# EasyEDA Pro project G431主控板.eprj

# Schematic Schematic1

## Sheets
1 P1: Board Name: Board1; Create Date: 2025-03-21; Page Name: P1; Project Name: G431主控板; Schematic Name: Schematic1; Update Date: 2025-05-21; Company: 嘉立创EDA; Page Size: A4; Version: V1.0
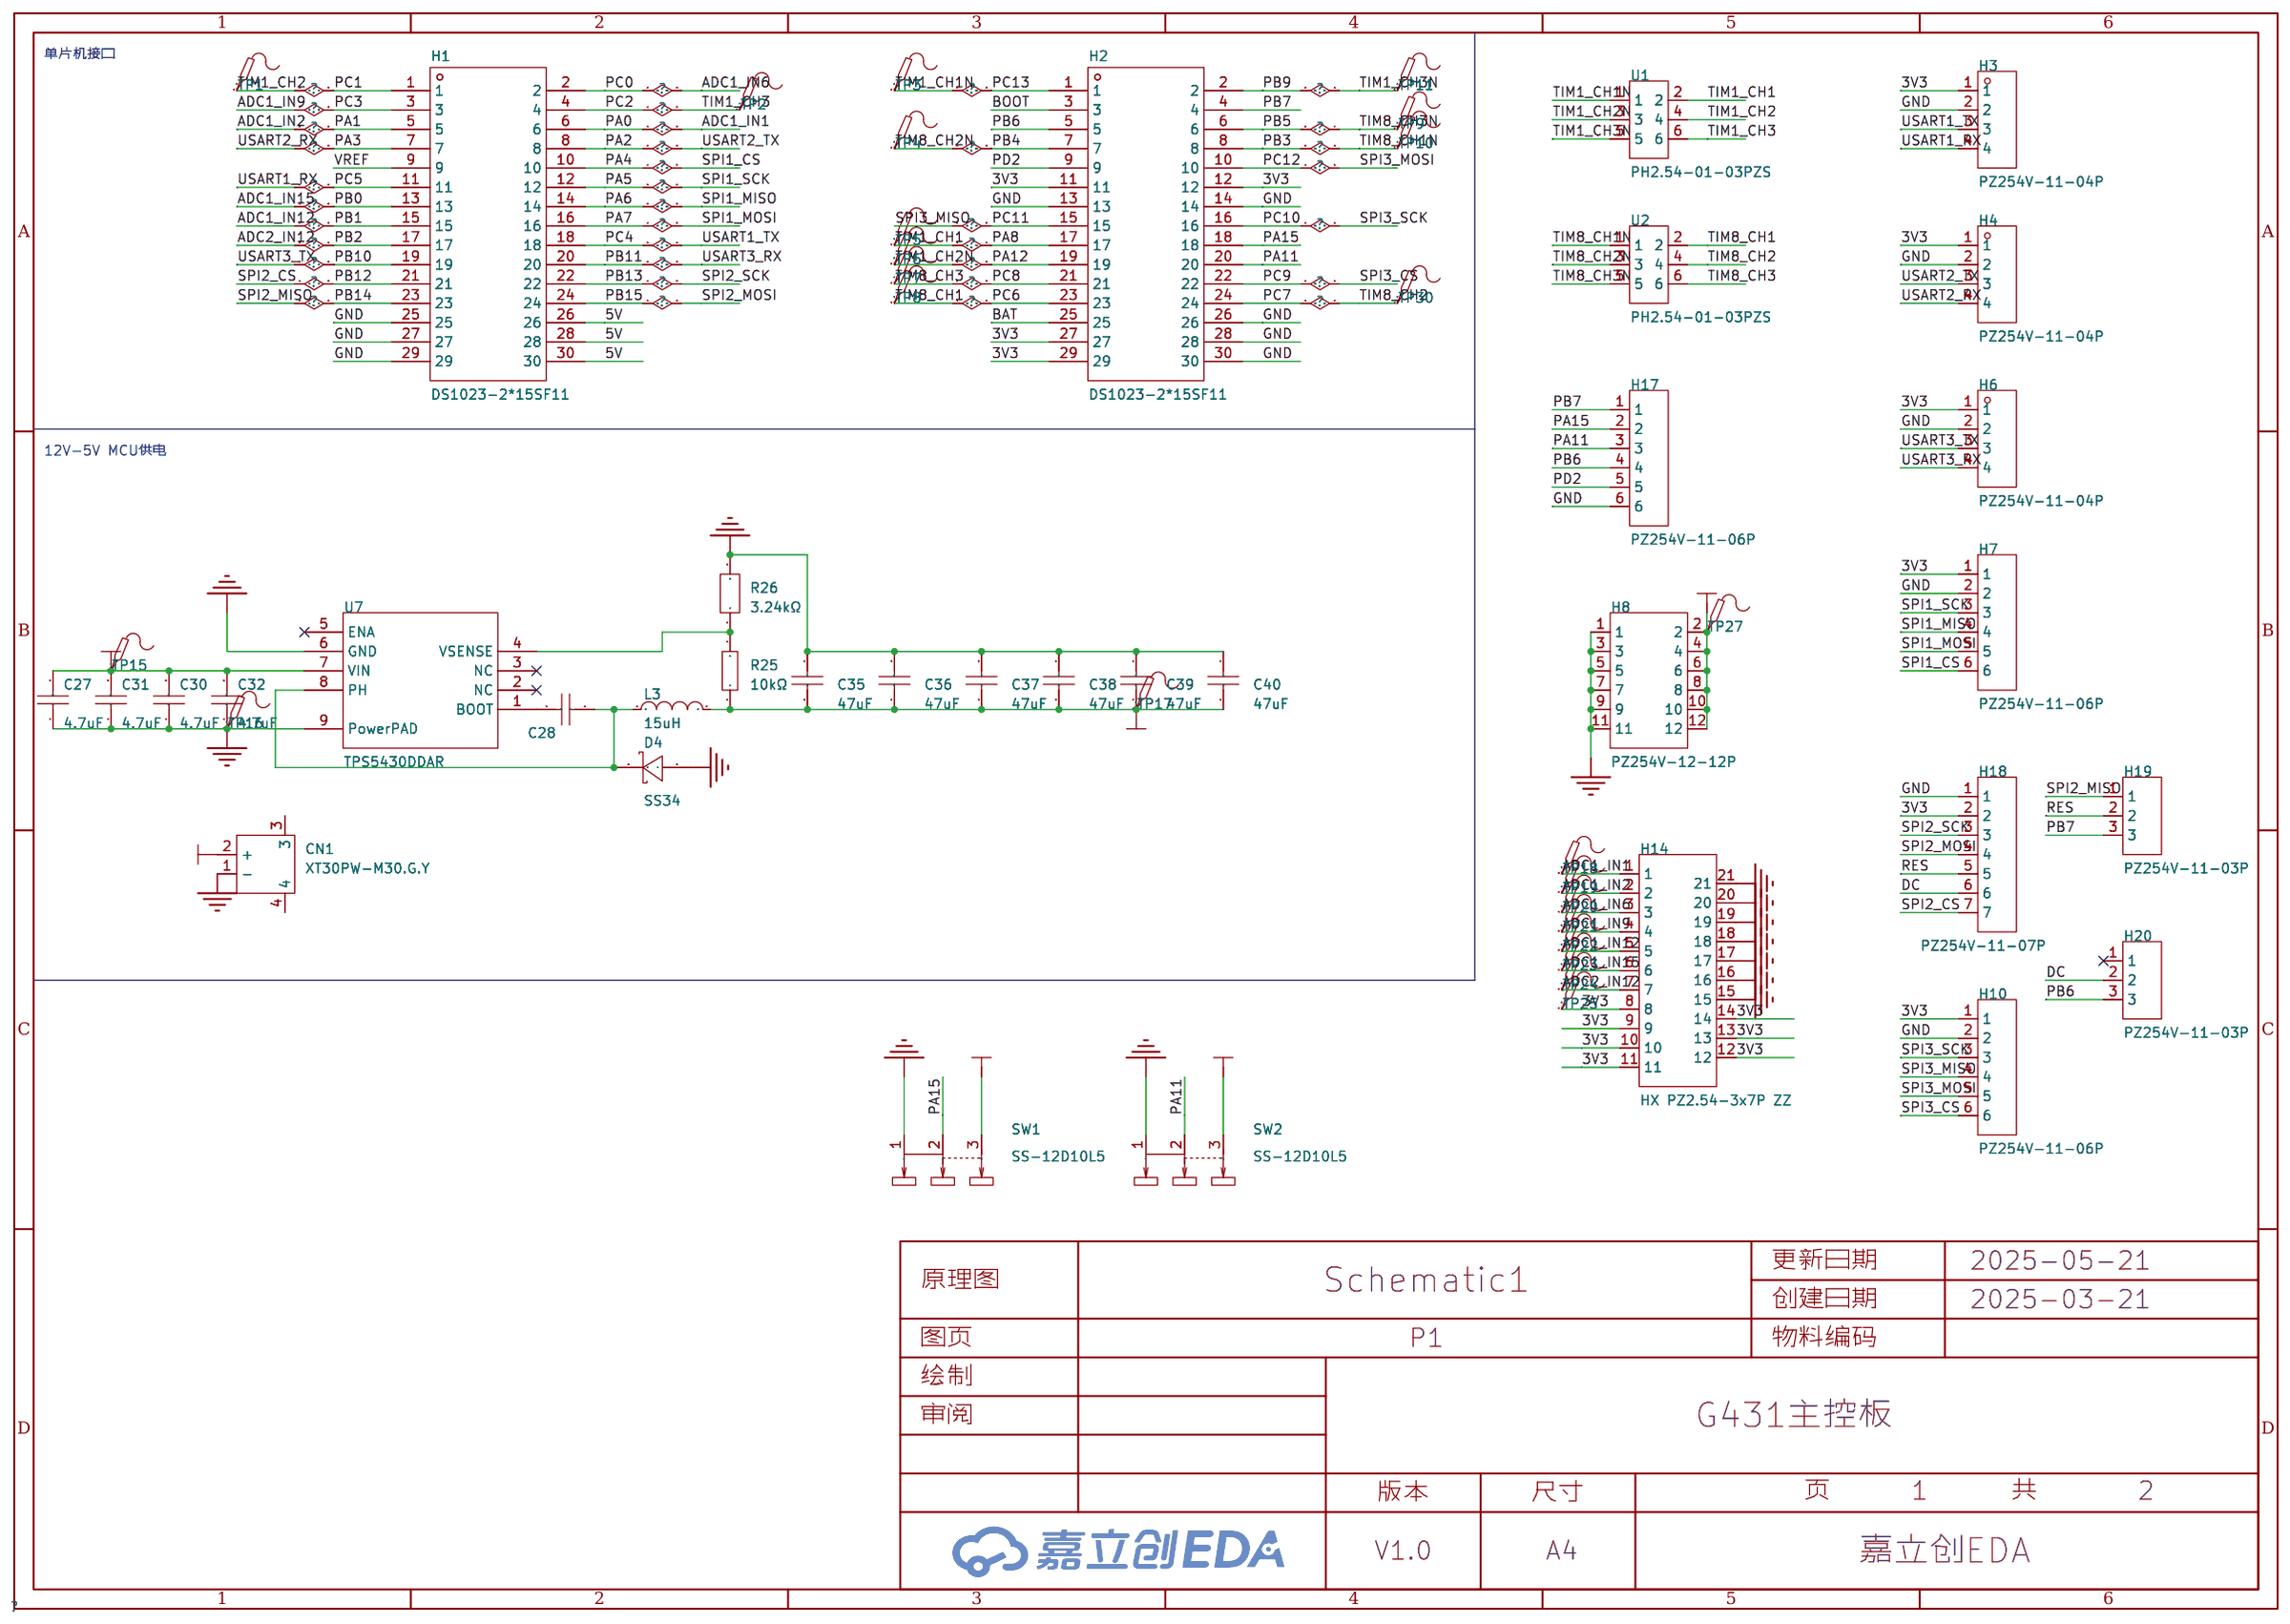
[diagram p0: P1]
2 P2: Create Date: 2025-05-21; Page Name: P2
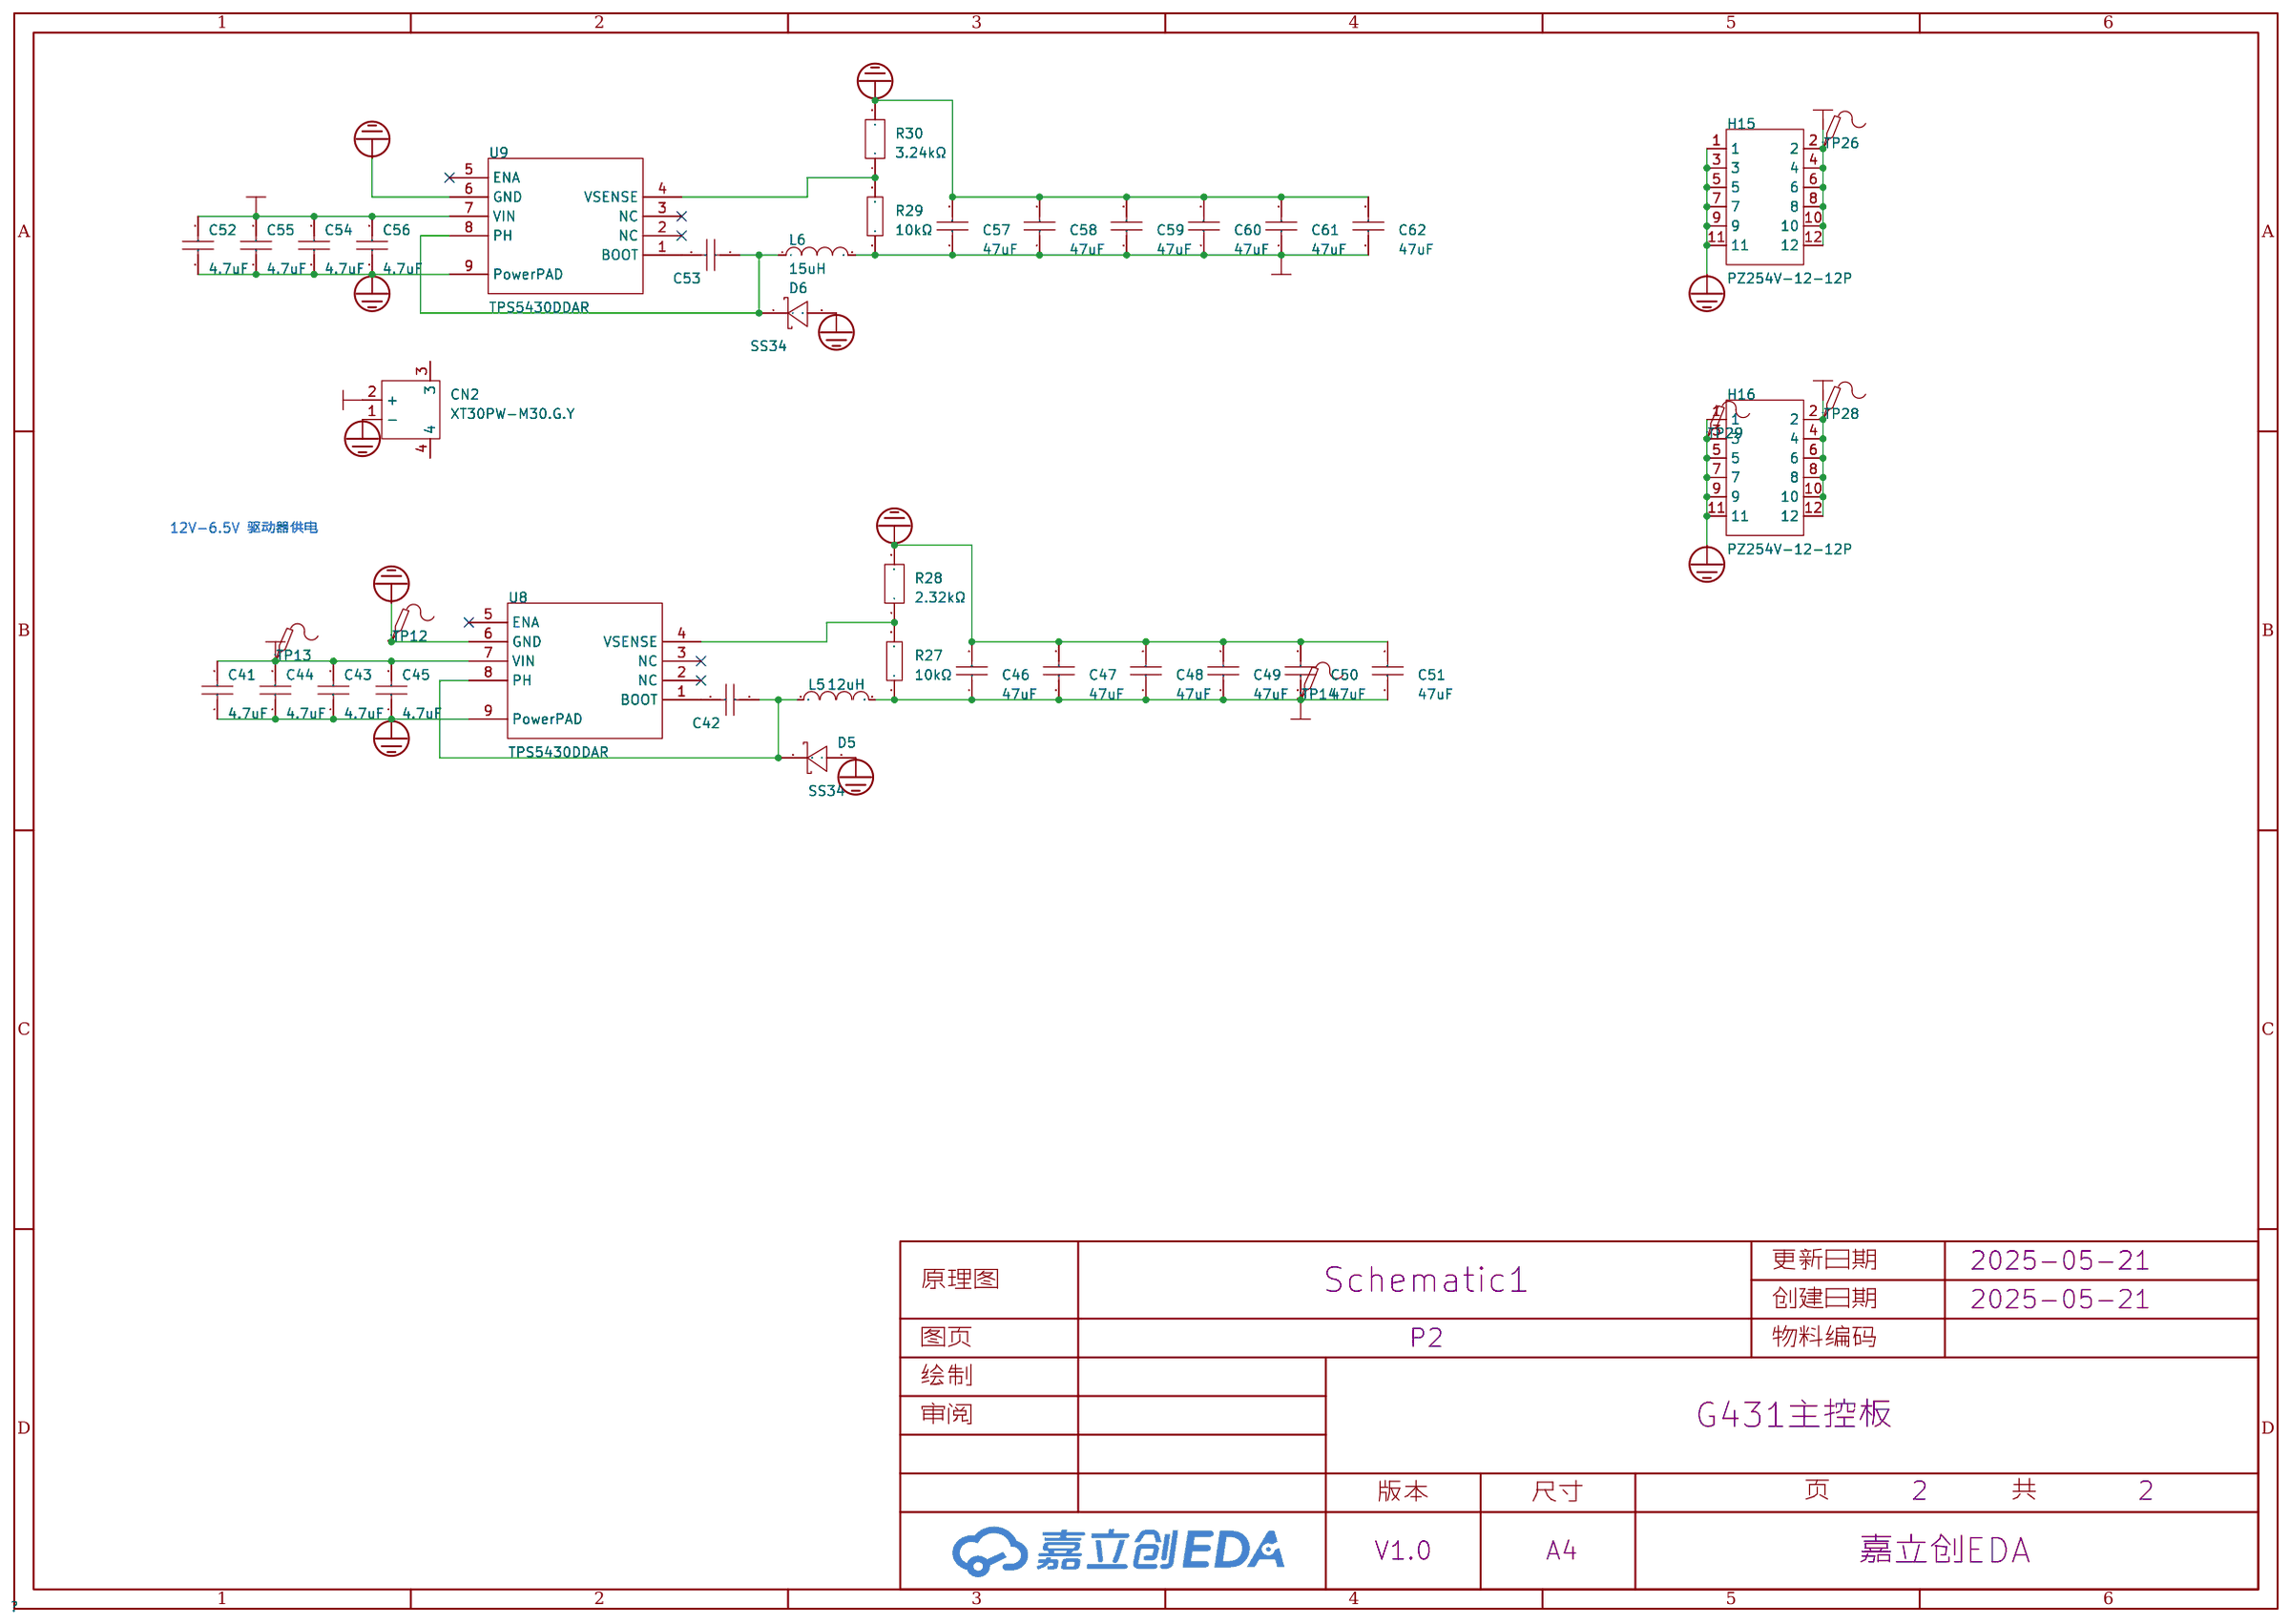
[diagram p1: P2]

## Parts
sheet P1
C27  4.7uF  [C0603]
C28  10nF  [C0603]
C30  4.7uF  [C0603]
C31  4.7uF  [C0603]
C32  4.7uF  [C0603]
C35  47uF  [C0805]
C36  47uF  [C0805]
C37  47uF  [C0805]
C38  47uF  [C0805]
C39  47uF  [C0805]
C40  47uF  [C0805]
CN1  XT30PW-M30.G.Y  [CONN-TH_XT30PW-M]
D4  SS34  [SMA_L4.3-W2.6-LS5.2-RD]
H1  DS1023-2*15SF11  [HDR-TH_30P-P2.54-V-F-R2-C15-S2.54]
H2  DS1023-2*15SF11  [HDR-TH_30P-P2.54-V-F-R2-C15-S2.54]
H3  PZ254V-11-04P  [HDR-TH_4P-P2.54-V-M]
H4  PZ254V-11-04P  [HDR-TH_4P-P2.54-V-M]
H6  PZ254V-11-04P  [HDR-TH_4P-P2.54-V-M]
H7  PZ254V-11-06P  [HDR-TH_6P-P2.54-V-M]
H8  PZ254V-12-12P  [HDR-TH_12P-P2.54-V-M-R2-C6-S2.54]
H10  PZ254V-11-06P  [HDR-TH_6P-P2.54-V-M]
H14  HX PZ2.54-3x7P ZZ  [CONN-TH_HX-PZ2.54-3X7P-ZZ]
H17  PZ254V-11-06P  [HDR-TH_6P-P2.54-V-M]
H18  PZ254V-11-07P  [HDR-TH_7P-P2.54-V-M]
H19  PZ254V-11-03P  [HDR-TH_3P-P2.54-V-M]
H20  PZ254V-11-03P  [HDR-TH_3P-P2.54-V-M]
L3  15uH  [IND-SMD_L5.2-W5.2_YSPI0530]
R25  10kΩ  [R0603]
R26  3.24kΩ  [R0603]
SW1  SS-12D10L5  [SW-TH_SS-12D10L5]
SW2  SS-12D10L5  [SW-TH_SS-12D10L5]
TP1  -  [Test-Point-0.5mm]
TP2  -  [Test-Point-0.5mm]
TP3  -  [Test-Point-0.5mm]
TP4  -  [Test-Point-0.5mm]
TP5  -  [Test-Point-0.5mm]
TP6  -  [Test-Point-0.5mm]
TP7  -  [Test-Point-0.5mm]
TP8  -  [Test-Point-0.5mm]
TP9  -  [Test-Point-0.5mm]
TP10  -  [Test-Point-0.5mm]
TP11  -  [Test-Point-0.5mm]
TP15  -  [Test-Point-0.5mm]
TP16  -  [Test-Point-0.5mm]
TP17  -  [Test-Point-0.5mm]
TP18  -  [Test-Point-0.5mm]
TP19  -  [Test-Point-0.5mm]
TP20  -  [Test-Point-0.5mm]
TP21  -  [Test-Point-0.5mm]
TP22  -  [Test-Point-0.5mm]
TP23  -  [Test-Point-0.5mm]
TP24  -  [Test-Point-0.5mm]
TP25  -  [Test-Point-0.5mm]
TP27  -  [Test-Point-0.5mm]
TP30  -  [Test-Point-0.5mm]
U1  PH2.54-01-03PZS  [HDR-TH_6P-P2.54-V-M-R2-C3-S2.54]
U2  PH2.54-01-03PZS  [HDR-TH_6P-P2.54-V-M-R2-C3-S2.54]
U7  TPS5430DDAR  [ESOP-8_L4.9-W3.9-P1.27-LS6.0-TL-EP]
sheet P2
C41  4.7uF  [C0603]
C42  10nF  [C0603]
C43  4.7uF  [C0603]
C44  4.7uF  [C0603]
C45  4.7uF  [C0603]
C46  47uF  [C0805]
C47  47uF  [C0805]
C48  47uF  [C0805]
C49  47uF  [C0805]
C50  47uF  [C0805]
C51  47uF  [C0805]
C52  4.7uF  [C0603]
C53  10nF  [C0603]
C54  4.7uF  [C0603]
C55  4.7uF  [C0603]
C56  4.7uF  [C0603]
C57  47uF  [C0805]
C58  47uF  [C0805]
C59  47uF  [C0805]
C60  47uF  [C0805]
C61  47uF  [C0805]
C62  47uF  [C0805]
CN2  XT30PW-M30.G.Y  [CONN-TH_XT30PW-M]
D5  SS34  [SMA_L4.3-W2.6-LS5.2-RD]
D6  SS34  [SMA_L4.3-W2.6-LS5.2-RD]
H15  PZ254V-12-12P  [HDR-TH_12P-P2.54-V-M-R2-C6-S2.54]
H16  PZ254V-12-12P  [HDR-TH_12P-P2.54-V-M-R2-C6-S2.54]
L5  12uH  [IND-SMD_L4.0-W4.0]
L6  15uH  [IND-SMD_L5.2-W5.2_YSPI0530]
R27  10kΩ  [R0603]
R28  2.32kΩ  [R0603]
R29  10kΩ  [R0603]
R30  3.24kΩ  [R0603]
TP12  -  [Test-Point-0.5mm]
TP13  -  [Test-Point-0.5mm]
TP14  -  [Test-Point-0.5mm]
TP26  -  [Test-Point-0.5mm]
TP28  -  [Test-Point-0.5mm]
TP29  -  [Test-Point-0.5mm]
U8  TPS5430DDAR  [ESOP-8_L4.9-W3.9-P1.27-LS6.0-TL-EP]
U9  TPS5430DDAR  [ESOP-8_L4.9-W3.9-P1.27-LS6.0-TL-EP]

## Library data of the parts
C27 C30-C32 C41 C43-C45 C52 C54-C56 = CL10A475KP8NNNC: 容值:4.7uF;精度:±10%;额定电压:10V;材质(温度系数):X5R;; LCSC Part Name: 4.7uF ±10% 10V; Supplier Part: C1705; Manufacturer: SAMSUNG(三星); Supplier Footprint: 0603; JLCPCB Part Class: 扩展库; Datasheet: https://atta.szlcsc.com/upload/public/pdf/source/20160218/1457707763339.pdf; Supplier: LCSC; Tolerance: ±10%; Voltage Rated: 10V; Temperature Coefficient: X5R
C28 C42 C53 = CC0603KRX7R9BB103: LCSC Part Name: 10nF ±10% 50V; Supplier Part: C100042; Manufacturer: YAGEO(国巨); Supplier Footprint: 0603; JLCPCB Part Class: 扩展库; Datasheet: https://atta.szlcsc.com/upload/public/pdf/source/20181008/C309510_22F155564471FAF6A489F7D68F34234E.pdf; Supplier: LCSC; Tolerance: ±10%; Voltage Rated: 50V; Temperature Coefficient: X7R
C35-C40 C46-C51 C57-C62 = CL21A476MQYNNNE: 容值:47uF;精度:±20%;额定电压:6.3V;材质(温度系数):X5R;; LCSC Part Name: 47uF ±20% 6.3V; Supplier Part: C16780; Manufacturer: SAMSUNG(三星); Supplier Footprint: 0805; JLCPCB Part Class: 基础库; Datasheet: https://atta.szlcsc.com/upload/public/pdf/source/20160218/1457707763339.pdf; Supplier: LCSC; Tolerance: ±20%; Voltage Rated: 6.3V; Temperature Coefficient: X5R
CN1 CN2 = XT30PW-M30.G.Y: LCSC Part Name: AMASS(艾迈斯)航模插头 卧式弯脚 XT30PW-M公头; Supplier Part: C431092; Manufacturer: AMASS(艾迈斯); JLCPCB Part Class: 扩展库; Datasheet: https://atta.szlcsc.com/upload/public/pdf/source/20220222/6A9F22F7850E25B33E1BE430ADF8560B.pdf; Supplier: LCSC; Type: 航模插头; RatedVoltage: DC 500V; InterfaceType: 公头; RatedCurrent: 15A; RecommendedWireGauge: 16/18/20AWG; contact resistance: 1.2mΩ; specifications: 2pin
D4-D6 = SS34_C8678: 二极管配置:独立式;正向压降(Vf):550mV@3A;直流反向耐压(Vr):40V;平均整流电流(Io):3A;; LCSC Part Name: 电压:40V 电流:3A; Supplier Part: C8678; Manufacturer: MDD; Supplier Footprint: SMA(DO-214AC); JLCPCB Part Class: 基础库; Datasheet: https://atta.szlcsc.com/upload/public/pdf/source/20230314/A80AE34493C69B89E2F4B1712F433538.pdf; Supplier: LCSC; Diode Configuration: 独立式; Forward Voltage (Vf@If): 550mV@3A; Reverse Voltage (Vr): 40V; Average Rectified Current (Io): 3A; Reverse Leakage Current (Ir): 500uA@40V
H1 H2 = DS1023-2*15SF11: 插孔结构:2x15P;间距:2.54mm;行距:2.54mm;安装类型:直插;排数:双排;总孔位数:30P;塑高:-;触头材质:-;触头镀层:-;; LCSC Part Name: 间距:2.54mm 2x15P 直插; Supplier Part: C132129; Manufacturer: CONNFLY; Supplier Footprint: 插件,P=2.54mm; JLCPCB Part Class: 扩展库; Datasheet: https://atta.szlcsc.com/upload/public/pdf/source/20170925/C132132_1506321659018990428.pdf; Supplier: LCSC; Holes Structure: 2x15P; Pitch: 2.54mm; Row Spacing: 2.54mm; Mounting Type: 直插; Number of Rows: 双排; Number of Holes: 30P
H3 H4 H6 = PZ254V-11-04P: LCSC Part Name: 间距:2.54mm 1x4P 直插 方针; Supplier Part: C2691448; Manufacturer: XFCN(兴飞); Supplier Footprint: 插件,P=2.54mm; JLCPCB Part Class: 扩展库; Datasheet: https://atta.szlcsc.com/upload/public/pdf/source/20200309/C492403_F9F19131791D08044AD4F84F8E751A34.pdf; Supplier: LCSC; Pin Structure: 1x4P; Pitch: 2.54mm; Circluar Pins/Square Pins: 方针; Mounting Type: 直插; Number of Rows: 单排; Number of Pins: 4P; Current Rating (Max): 3A; Voltage Rating (Max): 250V; Length of Mating Pin: 6mm; Insulation Height: 2.5mm; Length of End Connection Pin: 3mm; Operating Temperature Range: -40℃~+105℃; Color: 黑色
H7 H10 H17 = PZ254V-11-06P: LCSC Part Name: 1x6P 间距:2.54mm 方针 直插; Supplier Part: C492405; Manufacturer: XFCN(兴飞); Supplier Footprint: 插件,P=2.54mm; JLCPCB Part Class: 扩展库; Datasheet: https://atta.szlcsc.com/upload/public/pdf/source/20200309/C492405_597F1930F5B55CC3C7FD95458F1C3977.pdf; Supplier: LCSC; Pin Structure: 1x6P; Pitch: 2.54mm; Circluar Pins/Square Pins: 方针; Mounting Type: 直插; Number of Rows: 单排; Number of Pins: 6P; Length of Mating Pin: 6mm; Insulation Height: 2.5mm; Length of End Connection Pin: 3mm; Contact Material: 黄铜; Operating Temperature: -40℃~+105℃; Color: 黑色
H8 H15 H16 = PZ254V-12-12P: LCSC Part Name: 2x6P 间距:2.54mm 方针 直插; Supplier Part: C492423; Manufacturer: XFCN(兴飞); Supplier Footprint: 插件,P=2.54mm; JLCPCB Part Class: 扩展库; Datasheet: https://atta.szlcsc.com/upload/public/pdf/source/20200309/C492423_E4E2C9BC0EB9D59A2ABE4377D2E234B2.pdf; Supplier: LCSC; Pin Structure: 2x6P; Pitch: 2.54mm; Row Spacing: 2.54mm; Circluar Pins/Square Pins: 方针; Mounting Type: 直插; Number of Rows: 双排; Number of Pins: 12P; Length of Mating Pin: 6mm; Insulation Height: 2.5mm; Length of End Connection Pin: 3mm; Contact Material: 黄铜; Operating Temperature: -40℃~+105℃; Color: 黑色
H14 = HX PZ2.54-3x7P ZZ: LCSC Part Name: 3x7P 间距:2.54mm 方针 直插; Supplier Part: C32713294; Manufacturer: hanxia(韩下); Supplier Footprint: 插件,P=2.54mm; JLCPCB Part Class: 扩展库; Datasheet: https://atta.szlcsc.com/upload/public/pdf/source/20240723/0865035114635720ADAE8B7B33218890.pdf; Supplier: LCSC; Pin Structure: 3x7P; Pitch: 2.54mm; Row Spacing: 2.54mm; Circluar Pins/Square Pins: 方针; Mounting Type: 直插; Number of Rows: 三排; Number of Pins: 21P; Current Rating: 3A; Length of Mating Pin: 6mm; Insulation Height: 2.5mm; Length of End Connection Pin: 3mm; Contact Material: 黄铜; Contact Plating: 金; Operating Temperature: -40℃~+105℃; Color: 黑色
H18 = PZ254V-11-07P: LCSC Part Name: 1x7P 间距:2.54mm 方针 直插; Supplier Part: C492406; Manufacturer: XFCN(兴飞); Supplier Footprint: 插件,P=2.54mm; JLCPCB Part Class: 扩展库; Datasheet: https://atta.szlcsc.com/upload/public/pdf/source/20200309/C492406_654C533EE691117E22DD9F76C114C2D9.pdf; Supplier: LCSC; Pin Structure: 1x7P; Pitch: 2.54mm; Circluar Pins/Square Pins: 方针; Mounting Type: 直插; Number of Rows: 单排; Number of Pins: 7P; Length of Mating Pin: 6mm; Insulation Height: 2.5mm; Length of End Connection Pin: 3mm; Contact Material: 黄铜; Operating Temperature: -40℃~+105℃; Color: 黑色
H19 H20 = PZ254V-11-03P: LCSC Part Name: 1x3P 间距:2.54mm 方针 直插; Supplier Part: C2937625; Manufacturer: XFCN(兴飞); Supplier Footprint: 插件,P=2.54mm; JLCPCB Part Class: 扩展库; Datasheet: https://atta.szlcsc.com/upload/public/pdf/source/20200309/C492402_8335C3D49C4E4C618838D59BB1D024C1.pdf; Supplier: LCSC; Pin Structure: 1x3P; Pitch: 2.54mm; Circluar Pins/Square Pins: 方针; Mounting Type: 直插; Number of Rows: 单排; Number of Pins: 3P; Current Rating: 3A; Voltage Rating (Max): 250V; Length of Mating Pin: 6mm; Insulation Height: 2.5mm; Length of End Connection Pin: 3mm; Operating Temperature: -40℃~+105℃; Color: 黑色
L3 L6 = YSPI0530-150M: 电感值:15uH;精度:±20%;额定电流:2.1A;; LCSC Part Name: 15uH ±20%; Supplier Part: C497861; Manufacturer: YJYCOIN(益嘉源); Supplier Footprint: SMD,5.4x5.2x3mm; JLCPCB Part Class: 扩展库; Datasheet: https://atta.szlcsc.com/upload/public/pdf/source/20200317/C497860_F2BFA4F4324DE880FC2D7AD862E4A32B.pdf; Supplier: LCSC; Tolerance: ±20%; Rated Current: 2.1A; DC Resistance (DCR): 190mΩ
R25 R27 R29 = RT0603BRD0710KL: 电阻类型:薄膜电阻;阻值:10kΩ;精度:±0.1%;功率:100mW;最大工作电压:75V;温度系数:±25ppm/℃;; LCSC Part Name: 薄膜电阻 10kΩ ±0.1% 100mW; Supplier Part: C95204; Manufacturer: YAGEO(国巨); Supplier Footprint: 0603; JLCPCB Part Class: 扩展库; Datasheet: https://atta.szlcsc.com/upload/public/pdf/source/20170217/1487301593756.pdf; Supplier: LCSC; Type: 薄膜电阻; Tolerance: ±0.1%; Power(Watts): 100mW; Overload Voltage (Max): 75V; Temperature Coefficient: ±25ppm/℃; Operating Temperature Range: -55℃~+155℃
R26 R30 = RT0603BRB073K24L: 电阻类型:薄膜电阻;阻值:3.24kΩ;精度:±0.1%;功率:100mW;温度系数:±10ppm/℃;; LCSC Part Name: 薄膜电阻 3.24kΩ ±0.1% 100mW; Supplier Part: C860367; Manufacturer: YAGEO(国巨); Supplier Footprint: 0603; JLCPCB Part Class: 扩展库; Datasheet: https://atta.szlcsc.com/upload/public/pdf/source/20200610/C326738_5639A9F1B6EB6E4AE2197577D3456E7F.pdf; Supplier: LCSC; Type: 薄膜电阻; Tolerance: ±0.1%; Power(Watts): 100mW; Temperature Coefficient: ±10ppm/℃; Operating Temperature Range: -55℃~+155℃
SW1 SW2 = SS-12D10L5: LCSC Part Name: 柄长5mm 直插双档 滑动开关; Supplier Part: C319012; Manufacturer: XKB Connectivity(中国星坤); Supplier Footprint: 插件; JLCPCB Part Class: 扩展库; Datasheet: https://atta.szlcsc.com/upload/public/pdf/source/20211009/D6412F37AABE6F9459A6EE7FA4DAEADB.pdf; Supplier: LCSC; Circuit: 单刀双掷; Actuator Style: 矩形柱状; Pin Style: PC引脚; Switch Length: 13mm; Switch Width: 6.8mm; Switch Height: 6.4mm; Mounting Style: 直插; Actuator Color: 黑色; Current Rating (DC): 3A; Voltage Rating (DC): 125V; Current Rating (AC): 3A; Voltage Rating (AC): 125V; Mechanical Life: 1万次; Operating Temperature: -40℃~+85℃
TP1-TP30 = Test-Point
U1 U2 = PH2.54-01-03PZS: LCSC Part Name: 2x3P 间距:2.54mm 方针 直插; Supplier Part: C7501594; Manufacturer: XUNPU(讯普); Supplier Footprint: 插件,P=2.54mm; JLCPCB Part Class: 扩展库; Datasheet: https://atta.szlcsc.com/upload/public/pdf/source/20241122/C6659771919859911C7FDF3F9F3812CF.pdf; Supplier: LCSC; Pin Structure: 2x3P; Pitch: 2.54mm; Circluar Pins/Square Pins: 方针; Mounting Type: 直插; Number of Rows: 双排; Number of Pins: 6P; Length of Mating Pin: 6mm; Insulation Height: 2.5mm; Length of End Connection Pin: 3mm; Contact Material: 黄铜; Operating Temperature: -40℃~+105℃; Color: 黑色
U7-U9 = TPS5430DDAR: LCSC Part Name: 宽输入范围、3A输出电流的降压转换器; Supplier Part: C9864; Manufacturer: TI(德州仪器); Supplier Footprint: SOIC-8-EP; JLCPCB Part Class: 基础库; Datasheet: https://www.ti.com/cn/lit/gpn/tps5430; Supplier: LCSC; Function: 降压型; Output Type: 可调; Input Voltage: 5.5V~36V; Output Voltage: 1.221V~32.04V; Output Current: 3A; Switching Frequency: 500kHz; Operating Temperature: -40℃~+125℃@(TJ); Synchronous Rectification: 否; Number of Outputs: 1; Topology: 降压式; Switch tube (built-in/external): 内置; Output Current (Max): 3A
L5 = YNR4012-120M: LCSC Part Name: 12uH ±20%; Supplier Part: C497783; Manufacturer: YJYCOIN(益嘉源); Supplier Footprint: SMD,4x4x1.2mm; JLCPCB Part Class: 扩展库; Datasheet: https://atta.szlcsc.com/upload/public/pdf/source/20200317/C497775_B97ACFD3F1553E2A8E8AA921B9B778DC.pdf; Supplier: LCSC; Tolerance: ±20%; Rated Current: 660mA; DC Resistance (DCR): 290mΩ
R28 = RT0603BRD072K32L: LCSC Part Name: 薄膜电阻 2.32kΩ ±0.1% 100mW; Supplier Part: C861296; Manufacturer: YAGEO(国巨); Supplier Footprint: 0603; JLCPCB Part Class: 扩展库; Datasheet: https://atta.szlcsc.com/upload/public/pdf/source/20200610/C326738_5639A9F1B6EB6E4AE2197577D3456E7F.pdf; Supplier: LCSC; Type: 薄膜电阻; Tolerance: ±0.1%; Power(Watts): 100mW; Temperature Coefficient: ±25ppm/℃; Operating Temperature: -55℃~+155℃

## Nets
3V3: H2.11 H2.12 H2.27 H2.29 H3.1 H4.1 H6.1 H7.1 H10.1 H14.8 H14.9 H14.10 H14.11 H14.12 H14.13 H14.14 H18.2 SW1.3 SW2.3 TP25.1
5V: C35.1 C36.1 C37.1 C38.1 C39.1 C40.1 H1.26 H1.28 H1.30 H8.2 H8.4 H8.6 H8.8 H8.10 H8.12 L3.2 R25.1 TP17.1 TP27.1
5V_SAMPLE: C57.1 C58.1 C59.1 C60.1 C61.1 C62.1 H16.2 H16.4 H16.6 H16.8 H16.10 H16.12 L6.2 R29.1 TP28.1
6.5V: C46.1 C47.1 C48.1 C49.1 C50.1 C51.1 H15.2 H15.4 H15.6 H15.8 H15.10 H15.12 L5.2 R27.1 TP14.1 TP26.1
12V: C27.2 C30.2 C31.2 C32.2 CN1.2(+) TP15.1 U7.7(VIN)
12V_SAMPLE: C41.2 C43.2 C44.2 C45.2 C52.2 C54.2 C55.2 C56.2 CN2.2(+) TP13.1 U8.7(VIN) U9.7(VIN)
GND: C27.1 C30.1 C31.1 C32.1 C35.2 C36.2 C37.2 C38.2 C39.2 C40.2 CN1.1(-) D4.2(A) H1.25 H1.27 H1.29 H2.13 H2.14 H2.26 H2.28 H2.30 H3.2 H4.2 H6.2 H7.2 H8.1 H8.3 H8.5 H8.7 H8.9 H8.11 H10.2 H14.15 H14.16 H14.17 H14.18 H14.19 H14.20 H14.21 H17.6 H18.1 R26.2 SW1.1 SW2.1 TP16.1 U7.6(GND) U7.9(PowerPAD)
PGND: C41.1 C43.1 C44.1 C45.1 C46.2 C47.2 C48.2 C49.2 C50.2 C51.2 C52.1 C54.1 C55.1 C56.1 C57.2 C58.2 C59.2 C60.2 C61.2 C62.2 CN2.1(-) D5.2(A) D6.2(A) H15.1 H15.3 H15.5 H15.7 H15.9 H15.11 H16.1 H16.3 H16.5 H16.7 H16.9 H16.11 R28.2 R30.2 TP12.1 TP29.1 U8.6(GND) U8.9(PowerPAD) U9.6(GND) U9.9(PowerPAD)
ADC1_IN1: H1.6 H14.1 TP18.1
ADC1_IN2: H1.5 H14.2 TP19.1
ADC1_IN6: H1.2 H14.3 TP20.1
ADC1_IN9: H1.3 H14.4 TP21.1
ADC1_IN12: H1.15 H14.5 TP22.1
ADC1_IN15: H1.13 H14.6 TP23.1
ADC2_IN12: H1.17 H14.7 TP24.1
BAT: H2.25
BOOT: H2.3
DC: H18.6 H20.2
PA2: H1.8 H4.3
PA3: H1.7 H4.4
PA4: H1.10 H7.6
PA5: H1.12 H7.3
PA6: H1.14 H7.4
PA7: H1.16 H7.5
PA8: H2.17 TP5.1 U1.2
PA11: H2.20 H17.3 SW2.2
PA12: H2.19 TP6.1 U1.3
PA15: H2.18 H17.2 SW1.2
PB3: H2.8 TP10.1 U2.1
PB4: H2.7 TP4.1 U2.3
PB5: H2.6 TP9.1 U2.5
PB6: H2.5 H17.4 H20.3
PB7: H2.4 H17.1 H19.3
PB9: H2.2 TP11.1 U1.5
PB10: H1.19 H6.3
PB11: H1.20 H6.4
PB12: H1.21 H18.7
PB13: H1.22 H18.3
PB14: H1.23 H19.1
PB15: H1.24 H18.4
PC1: H1.1 TP1.1 U1.4
PC2: H1.4 TP2.1 U1.6
PC4: H1.18 H3.3
PC5: H1.11 H3.4
PC6: H2.23 TP8.1 U2.2
PC7: H2.24 TP30.1 U2.4
PC8: H2.21 TP7.1 U2.6
PC9: H2.22 H10.6
PC10: H2.16 H10.3
PC11: H2.15 H10.4
PC12: H2.10 H10.5
PC13: H2.1 TP3.1 U1.1
PD2: H2.9 H17.5
RES: H18.5 H19.2
VREF: H1.9
$1N5567: C28.1 D4.1(K) L3.1 U7.8(PH)
$1N5568: C28.2 U7.1(BOOT)
$1N5569: R25.2 R26.1 U7.4(VSENSE)
$2N774: C53.2 U9.1(BOOT)
$2N775: C53.1 D6.1(K) L6.1 U9.8(PH)
$2N778: R29.2 R30.1 U9.4(VSENSE)
$2N2986: C42.1 D5.1(K) L5.1 U8.8(PH)
$2N2987: C42.2 U8.1(BOOT)
$2N2990: R27.2 R28.1 U8.4(VSENSE)

Not connected (* = marked no-connect by the designer): CN1 3 4; CN2 3 4; H20 1*; U7 2(NC)* 3(NC)* 5(ENA)*; U8 2(NC)* 3(NC)* 5(ENA)*; U9 2(NC)* 3(NC)* 5(ENA)*

## Notes on the sheets
sheet 1
- 单片机接口
- 12V-5V MCU供电
sheet 2
- 12V-6.5V 驱动器供电

# Board PCB1
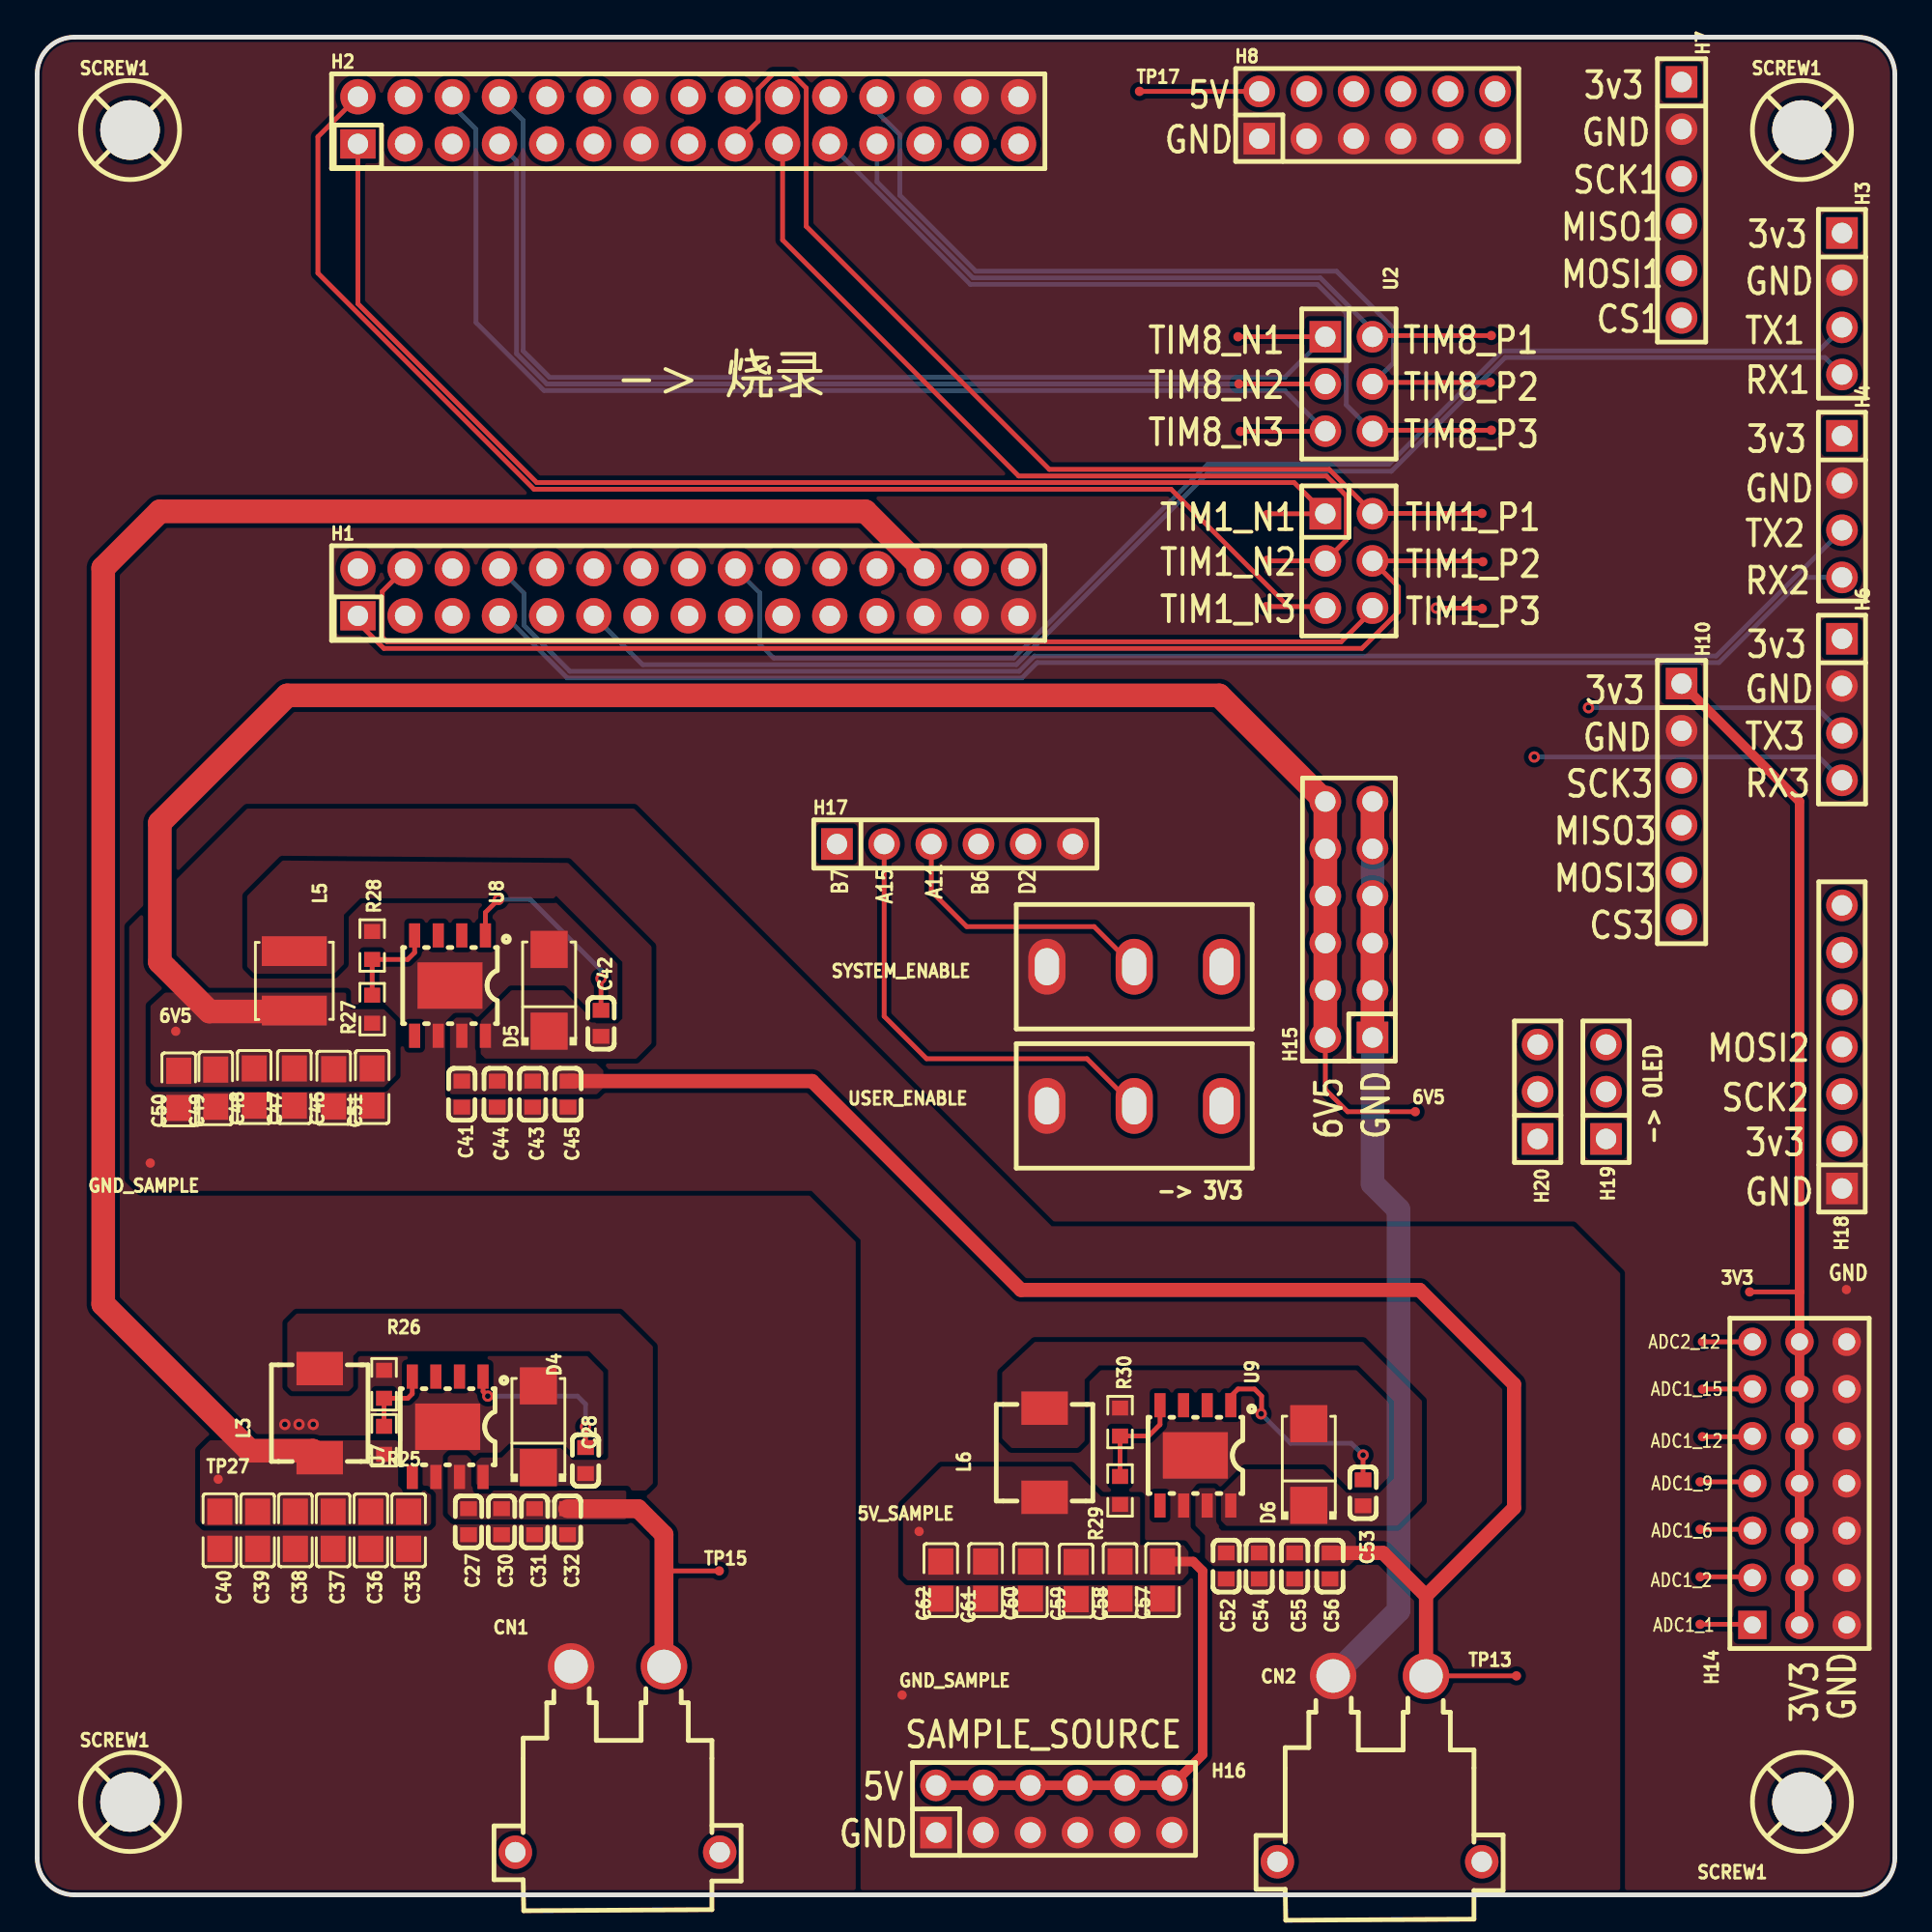
[diagram p2: board, top side]
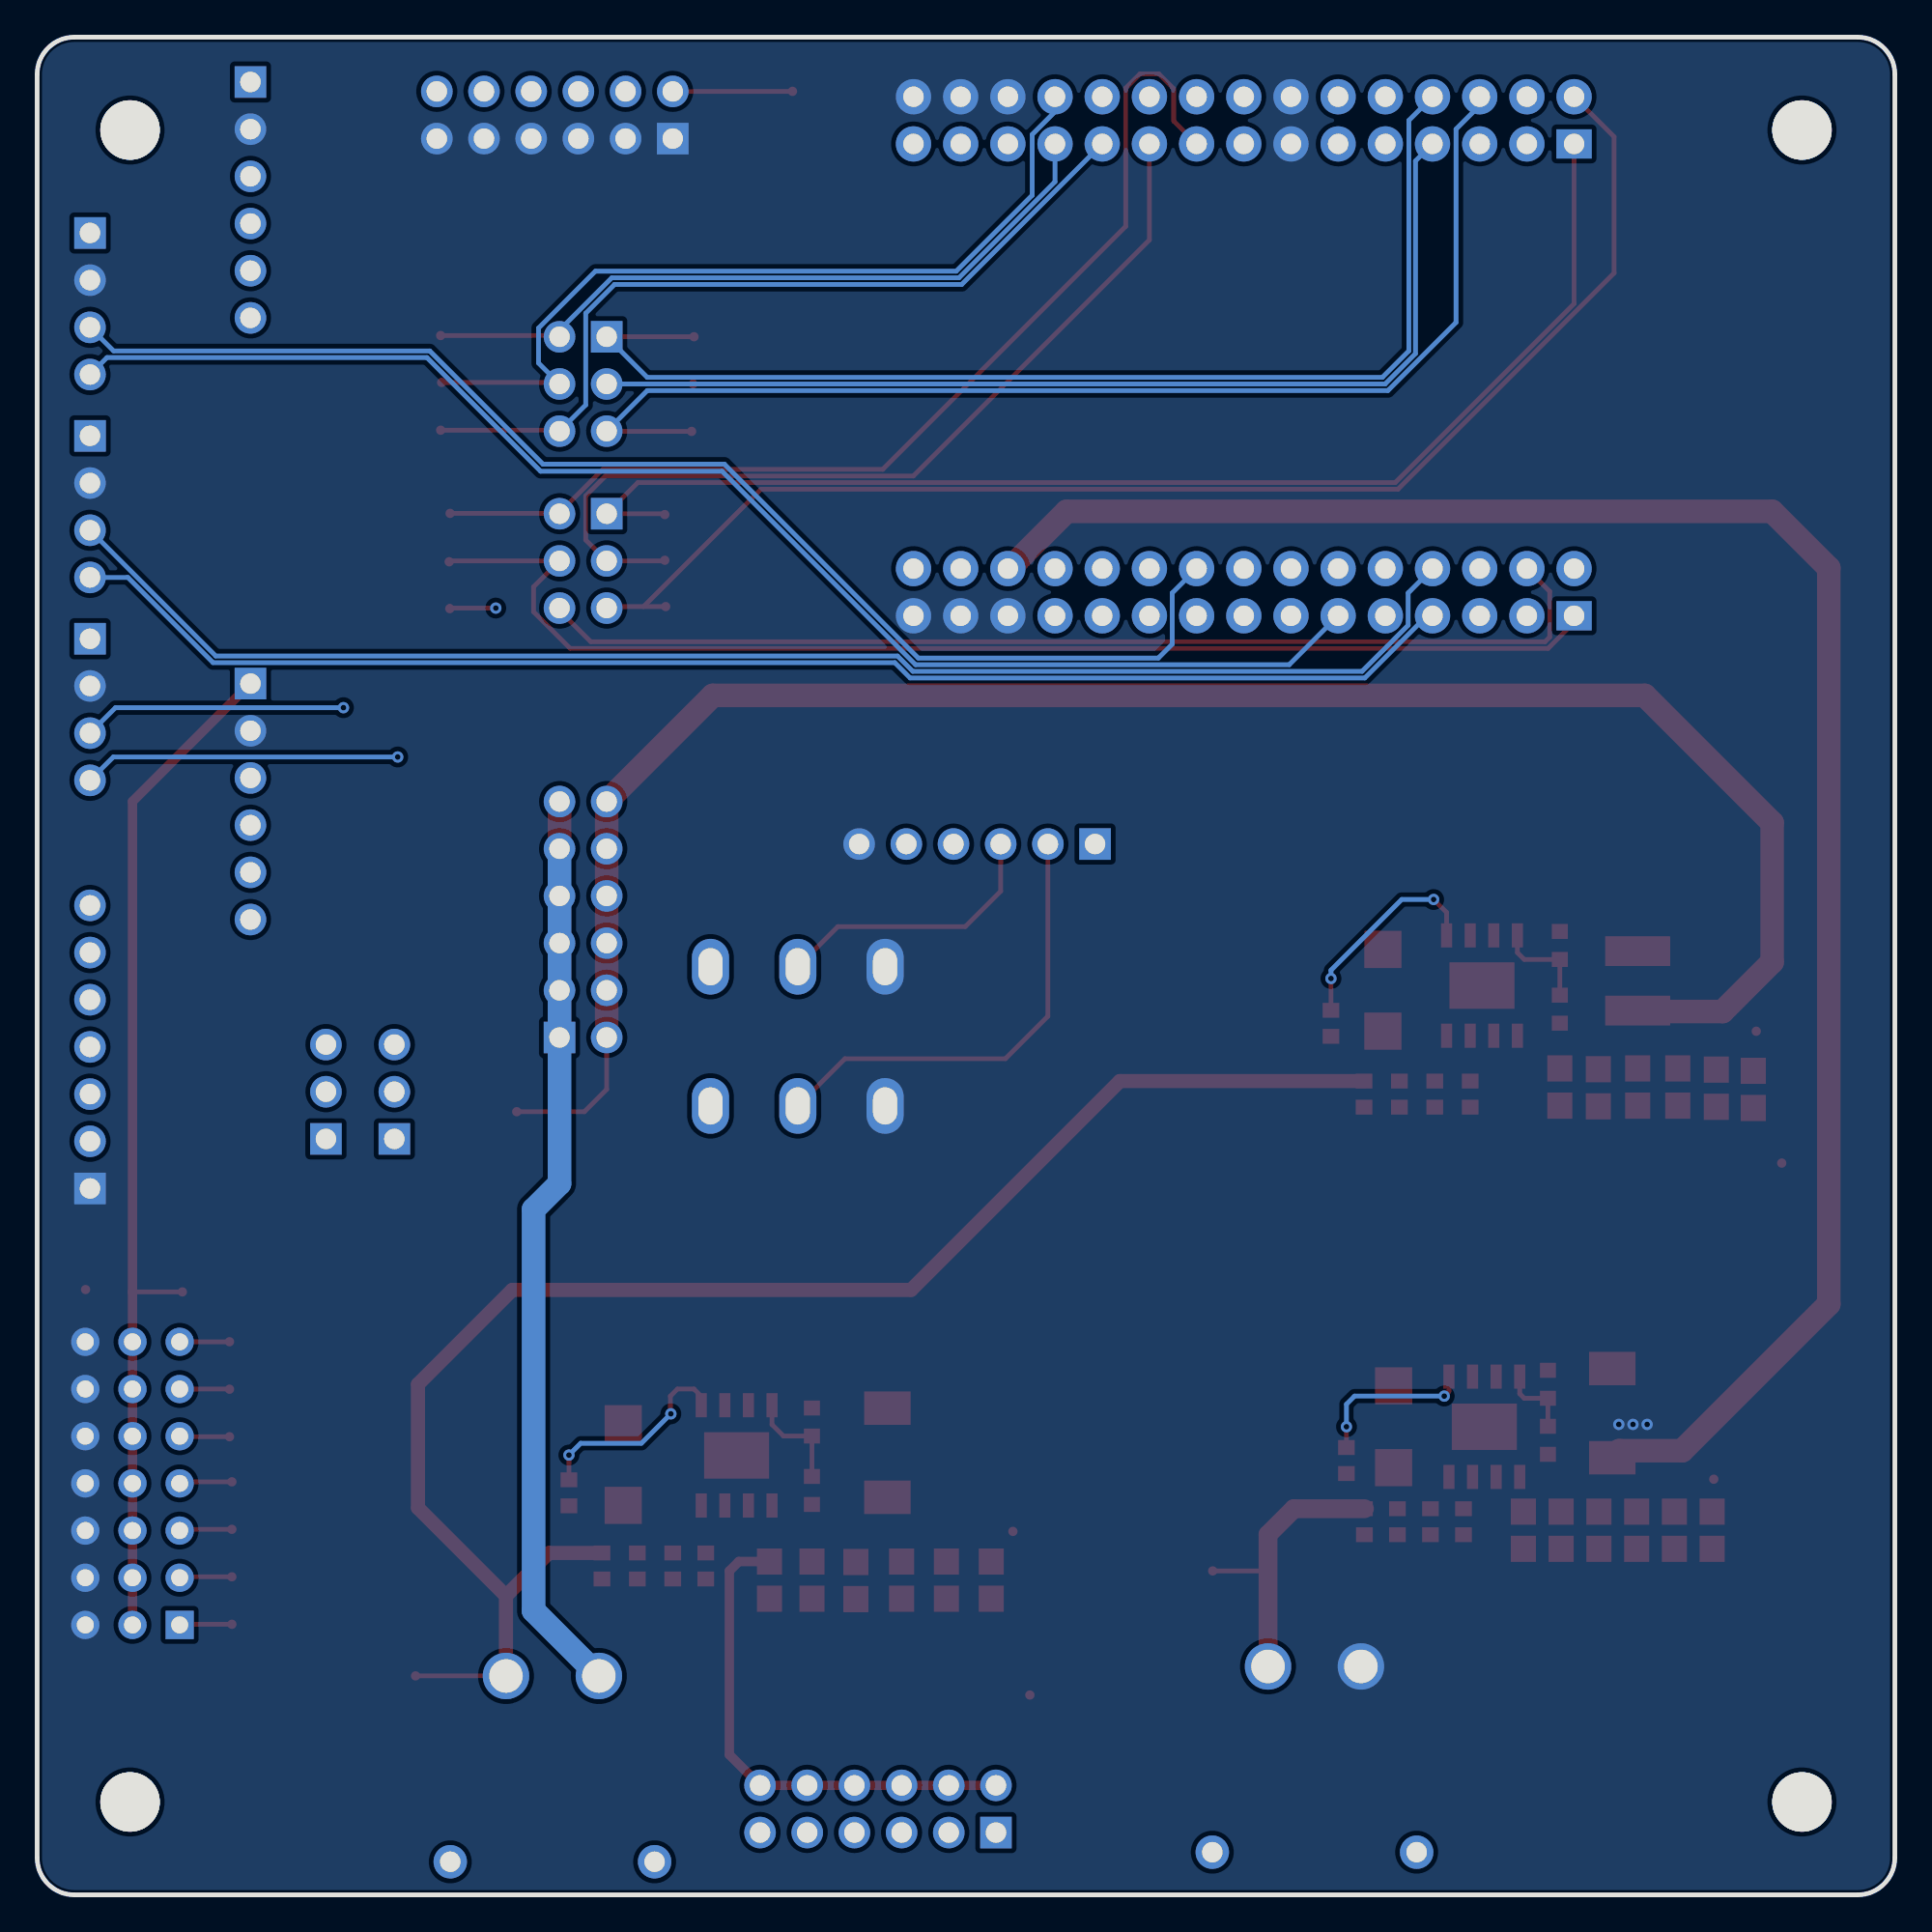
[diagram p3: board, bottom side, seen from below]

Outline 100 x 100 mm; copper layers: Top Layer, Inner1, Inner2, Bottom Layer. Coordinates in mm from the lower left corner of the outline.
Outline path: 0,98 0,2 arc(0.59,0.59) 2,0 98,0 arc(99.41,0.59) 100,2 100,98 arc(99.41,99.41) 98,100 2,100 arc(0.59,99.41) 0,98
Stack: Top Layer 0.035mm 外层铜厚1oz / Dielectric1 0.2104mm 7628 RC49% 8.6mil / Inner1 0.0152mm 内层铜厚 / Dielectric2 1.065mm 1.1mm H/HOZ Copper / Inner2 0.0152mm 内层铜厚 / Dielectric3 0.2104mm 7628 RC49% 8.6mil / Bottom Layer 0.035mm 外层铜厚1oz

## Design rules (mm)
template: 自定义配置
spacing copperThickness1oz (default): track to track 0.102, other pairs 0.152 to 0.3
spacing copperThickness2oz: track to track 0.203, other pairs 0.152 to 0.3
track width copperThickness1oz (default): min 0.127, default 0.254, max 2.54
track width copperThickness2oz: min 0.203, default 0.254, max 2.54
differential pair differentialPair (default): width min 0.127, default 0.254, max 2.54; gap min 0.152, default 0.152
via viaSize (default): diameter min 0.5, default 0.61, max 10; hole min 0.3, default 0.305, max 6.3

## Placement (name value [footprint] x y rotation side)
3V3  -  [Test-Point-0.5mm]  92.19 32.46 0 top
5V_SAMPLE  -  [Test-Point-0.5mm]  47.48 19.56 0 top
6V5  -  [Test-Point-0.5mm]  74.18 42.16 0 top
6V5#2  -  [Test-Point-0.5mm]  7.46 46.49 0 top
C27  4.7uF  [C0603]  23.22 20.09 90 top
C28  10nF  [C0603]  29.52 23.38 90 top
C30  4.7uF  [C0603]  25 20.09 90 top
C31  4.7uF  [C0603]  26.78 20.09 90 top
C32  4.7uF  [C0603]  28.55 20.09 90 top
C35  47uF  [C0805]  20 19.63 270 top
C36  47uF  [C0805]  17.96 19.63 270 top
C37  47uF  [C0805]  15.93 19.63 270 top
C38  47uF  [C0805]  13.9 19.63 270 top
C39  47uF  [C0805]  11.87 19.63 270 top
C40  47uF  [C0805]  9.84 19.63 270 top
C41  4.7uF  [C0603]  22.86 43.1 90 top
C42  10nF  [C0603]  30.35 46.91 90 top
C43  4.7uF  [C0603]  26.67 43.1 90 top
C44  4.7uF  [C0603]  24.77 43.1 90 top
C45  4.7uF  [C0603]  28.57 43.1 90 top
C46  47uF  [C0805]  15.96 43.44 270 top
C47  47uF  [C0805]  13.84 43.48 270 top
C48  47uF  [C0805]  11.68 43.48 270 top
C49  47uF  [C0805]  9.61 43.42 270 top
C50  47uF  [C0805]  7.62 43.36 270 top
C51  47uF  [C0805]  18.03 43.48 270 top
C52  4.7uF  [C0603]  64.01 17.7 90 top
C53  10nF  [C0603]  71.37 21.64 90 top
C54  4.7uF  [C0603]  65.79 17.7 90 top
C55  4.7uF  [C0603]  67.69 17.7 90 top
C56  4.7uF  [C0603]  69.6 17.7 90 top
C57  47uF  [C0805]  60.58 16.94 270 top
C58  47uF  [C0805]  58.29 16.94 270 top
C59  47uF  [C0805]  55.93 16.92 270 top
C60  47uF  [C0805]  53.47 16.94 270 top
C61  47uF  [C0805]  51.05 16.94 270 top
C62  47uF  [C0805]  48.64 16.94 270 top
CN1  XT30PW-M30.G.Y  [CONN-TH_XT30PW-M]  31.24 7.29 0 top
CN2  XT30PW-M30.G.Y  [CONN-TH_XT30PW-M]  72.26 6.78 0 top
D4  SS34  [SMA_L4.3-W2.6-LS5.2-RD]  26.98 25.2 90 top
D5  SS34  [SMA_L4.3-W2.6-LS5.2-RD]  27.56 48.69 90 top
D6  SS34  [SMA_L4.3-W2.6-LS5.2-RD]  68.45 23.16 90 top
GND_SAMPLE  -  [Test-Point-0.5mm]  46.56 10.76 0 top
GND_SAMPLE#2  -  [Test-Point-0.5mm]  6.09 39.39 0 top
H1  DS1023-2*15SF11  [HDR-TH_30P-P2.54-V-F-R2-C15-S2.54]  35.05 70.12 0 top
H2  DS1023-2*15SF11  [HDR-TH_30P-P2.54-V-F-R2-C15-S2.54]  35.05 95.52 0 top
H3  PZ254V-11-04P  [HDR-TH_4P-P2.54-V-M]  97.16 85.65 270 top
H4  PZ254V-11-04P  [HDR-TH_4P-P2.54-V-M]  97.16 74.73 270 top
H6  PZ254V-11-04P  [HDR-TH_4P-P2.54-V-M]  97.16 63.81 270 top
H7  PZ254V-11-06P  [HDR-TH_6P-P2.54-V-M]  88.52 91.24 270 top
H8  PZ254V-12-12P  [HDR-TH_12P-P2.54-V-M-R2-C6-S2.54]  72.14 95.81 0 top
H10  PZ254V-11-06P  [HDR-TH_6P-P2.54-V-M]  88.52 58.85 270 top
H14  HX PZ2.54-3x7P ZZ  [CONN-TH_HX-PZ2.54-3X7P-ZZ]  94.87 22.15 90 top
H15  PZ254V-12-12P  [HDR-TH_12P-P2.54-V-M-R2-C6-S2.54]  70.61 52.5 90 top
H16  PZ254V-12-12P  [HDR-TH_12P-P2.54-V-M-R2-C6-S2.54]  54.74 4.62 0 top
H17  PZ254V-11-06P  [HDR-TH_6P-P2.54-V-M]  49.4 56.57 0 top
H18  PZ254V-11-07P  [HDR-TH_7P-P2.54-V-M]  97.16 45.64 90 top
H19  PZ254V-11-03P  [HDR-TH_3P-P2.54-V-M]  84.46 43.23 90 top
H20  PZ254V-11-03P  [HDR-TH_3P-P2.54-V-M]  80.77 43.23 90 top
L3  15uH  [IND-SMD_L5.2-W5.2_YSPI0530]  15.21 25.93 270 top
L5  12uH  [IND-SMD_L4.0-W4.0]  13.84 49.2 270 top
L6  15uH  [IND-SMD_L5.2-W5.2_YSPI0530]  54.23 23.8 270 top
R25  10kΩ  [R0603]  18.67 24.47 90 top
R26  3.24kΩ  [R0603]  18.67 27.48 90 top
R27  10kΩ  [R0603]  18.03 47.68 90 top
R28  2.32kΩ  [R0603]  18.03 51.11 90 top
R29  10kΩ  [R0603]  58.29 21.77 90 top
R30  3.24kΩ  [R0603]  58.29 25.45 90 top
SCREW1  -  [M3螺丝]  95 95 0 top
SCREW1#2  -  [M3螺丝]  95 5 0 top
SCREW1#3  -  [M3螺丝]  5 5 0 top
SCREW1#4  -  [M3螺丝]  5 95 0 top
SYSTEM_ENABLE  SS-12D10L5  [SW-TH_SS-12D10L5]  59.06 49.96 0 top
TP1  -  [Test-Point-0.5mm]  77.82 71.76 0 top
TP2  -  [Test-Point-0.5mm]  77.79 69.24 0 top
TP3  -  [Test-Point-0.5mm]  66.21 74.3 0 top
TP4  -  [Test-Point-0.5mm]  64.69 81.33 0 top
TP5  -  [Test-Point-0.5mm]  77.77 74.36 0 top
TP6  -  [Test-Point-0.5mm]  66.21 71.84 0 top
TP7  -  [Test-Point-0.5mm]  78.28 78.84 0 top
TP8  -  [Test-Point-0.5mm]  78.28 83.94 0 top
TP9  -  [Test-Point-0.5mm]  64.77 78.78 0 top
TP10  -  [Test-Point-0.5mm]  64.64 83.87 0 top
TP11  -  [Test-Point-0.5mm]  66.17 69.35 0 top
TP13  -  [Test-Point-0.5mm]  79.63 11.79 0 top
TP15  -  [Test-Point-0.5mm]  36.72 17.44 0 top
TP16  -  [Test-Point-0.5mm]  97.39 32.58 0 top
TP17  -  [Test-Point-0.5mm]  59.34 97.08 0 top
TP18  -  [Test-Point-0.5mm]  89.52 14.56 0 top
TP19  -  [Test-Point-0.5mm]  89.52 17.12 0 top
TP20  -  [Test-Point-0.5mm]  89.52 19.68 0 top
TP21  -  [Test-Point-0.5mm]  89.52 22.23 0 top
TP22  -  [Test-Point-0.5mm]  89.65 24.66 0 top
TP23  -  [Test-Point-0.5mm]  89.65 27.22 0 top
TP24  -  [Test-Point-0.5mm]  89.65 29.77 0 top
TP27  -  [Test-Point-0.5mm]  9.75 22.37 0 top
TP30  -  [Test-Point-0.5mm]  78.23 81.41 0 top
U1  PH2.54-01-03PZS  [HDR-TH_6P-P2.54-V-M-R2-C3-S2.54]  70.61 71.81 270 top
U2  PH2.54-01-03PZS  [HDR-TH_6P-P2.54-V-M-R2-C3-S2.54]  70.61 81.33 270 top
U7  TPS5430DDAR  [ESOP-8_L4.9-W3.9-P1.27-LS6.0-TL-EP]  22.1 25.2 270 top
U8  TPS5430DDAR  [ESOP-8_L4.9-W3.9-P1.27-LS6.0-TL-EP]  22.22 48.95 270 top
U9  TPS5430DDAR  [ESOP-8_L4.9-W3.9-P1.27-LS6.0-TL-EP]  62.35 23.66 270 top
USER_ENABLE  SS-12D10L5  [SW-TH_SS-12D10L5]  59.06 42.47 0 top

## Footprints (pads in the part's own frame, mm; a bottom-side part is the same pattern mirrored in y, then rotated)
C0603
  rect 0.8x0.9 smd: 1(-0.7,0) 2(0.7,0)
C0805
  rect 1.41x1.35 smd: 1(-1,0) 2(1,0)
CONN-TH_HX-PZ2.54-3X7P-ZZ
  rect 1.524x1.524 hole 0.914: 1(-7.62,2.54)
  round 1.524 hole 0.914: 2(-5.08,2.54) 3(-2.54,2.54) 4(0,2.54) 5(2.54,2.54) 6(5.08,2.54) 7(7.62,2.54) 8(-7.62,0) 9(-5.08,0) 10(-2.54,0) 11(0,0) 12(2.54,0) 13(5.08,0) 14(7.62,0) 15(-7.62,-2.54) 16(-5.08,-2.54) 17(-2.54,-2.54) 18(0,-2.54) 19(2.54,-2.54) 20(5.08,-2.54) 21(7.62,-2.54)
CONN-TH_XT30PW-M
  round 2.5 hole 1.8: 1(-2.5,5) 2(2.5,5)
  round 1.8 hole 1.1: 3(5.5,-5) 4(-5.5,-5)
ESOP-8_L4.9-W3.9-P1.27-LS6.0-TL-EP
  rect 1.3x0.6 smd: 1(-2.7,1.905) 2(-2.7,0.635) 3(-2.7,-0.635) 4(-2.7,-1.905) 5(2.7,-1.905) 6(2.7,-0.635) 7(2.7,0.635) 8(2.7,1.905)
  rect 2.5x3.5 smd: 9(0,0)
HDR-TH_3P-P2.54-V-M
  rect 1.7x1.7 hole 1.1: 1(-2.54,0)
  round 1.7 hole 1.1: 2(0,0) 3(2.54,0)
HDR-TH_4P-P2.54-V-M
  rect 1.7x1.7 hole 1.1: 1(-3.81,0)
  round 1.7 hole 1.1: 2(-1.27,0) 3(1.27,0) 4(3.81,0)
HDR-TH_6P-P2.54-V-M
  rect 1.7x1.7 hole 1.1: 1(-6.35,0)
  round 1.7 hole 1.1: 2(-3.81,0) 3(-1.27,0) 4(1.27,0) 5(3.81,0) 6(6.35,0)
HDR-TH_6P-P2.54-V-M-R2-C3-S2.54
  rect 1.7x1.7 hole 1.1: 1(-2.54,-1.27)
  round 1.7 hole 1.1: 2(-2.54,1.27) 3(0,-1.27) 4(0,1.27) 5(2.54,-1.27) 6(2.54,1.27)
HDR-TH_7P-P2.54-V-M
  rect 1.7x1.7 hole 1.1: 1(-7.62,0)
  round 1.7 hole 1.1: 2(-5.08,0) 3(-2.54,0) 4(0,0) 5(2.54,0) 6(5.08,0) 7(7.62,0)
HDR-TH_12P-P2.54-V-M-R2-C6-S2.54
  rect 1.7x1.7 hole 1.1: 1(-6.35,-1.27)
  round 1.7 hole 1.1: 2(-6.35,1.27) 3(-3.81,-1.27) 4(-3.81,1.27) 5(-1.27,-1.27) 6(-1.27,1.27) 7(1.27,-1.27) 8(1.27,1.27) 9(3.81,-1.27) 10(3.81,1.27) 11(6.35,-1.27) 12(6.35,1.27)
HDR-TH_30P-P2.54-V-F-R2-C15-S2.54
  rect 1.9x1.575 hole 1.1: 1(-17.78,-1.27)
  round 1.9 hole 1.1: 2(-17.78,1.27) 3(-15.24,-1.27) 4(-15.24,1.27) 5(-12.7,-1.27) 6(-12.7,1.27) 7(-10.16,-1.27) 8(-10.16,1.27) 9(-7.62,-1.27) 10(-7.62,1.27) 11(-5.08,-1.27) 12(-5.08,1.27) 13(-2.54,-1.27) 14(-2.54,1.27) 15(0,-1.27) 16(0,1.27) 17(2.54,-1.27) 18(2.54,1.27) 19(5.08,-1.27) 20(5.08,1.27) 21(7.62,-1.27) 22(7.62,1.27) 23(10.16,-1.27) 24(10.16,1.27) 25(12.7,-1.27) 26(12.7,1.27) 27(15.24,-1.27) 28(15.24,1.27) 29(17.78,-1.27) 30(17.78,1.27)
IND-SMD_L4.0-W4.0
  rect 1.6x3.5 smd: 1(-1.6,0) 2(1.6,0)
IND-SMD_L5.2-W5.2_YSPI0530
  rect 1.8x2.5 smd: 1(-2.4,0) 2(2.4,0)
M3螺丝
  round 3.2 hole 3.2: 1(0,0)
R0603
  rect 0.806x0.864 smd: 1(-0.753,0) 2(0.753,0)
SMA_L4.3-W2.6-LS5.2-RD
  rect 2x2 smd: 1(-2.2,0) 2(2.2,0)
SW-TH_SS-12D10L5
  oval 2x3 hole 1.3x2: 1(-4.7,0) 2(0,0) 3(4.7,0)
Test-Point-0.5mm
  round 0.5 smd: 1(0,0)

## Nets
As in the schematic, except:
3V3: 3V3.1 H2.11 H2.12 H2.27 H2.29 H3.1 H4.1 H6.1 H7.1 H10.1 H14.8 H14.9 H14.10 H14.11 H14.12 H14.13 H14.14 H18.2 SYSTEM_ENABLE.3 USER_ENABLE.3
5V_SAMPLE: 5V_SAMPLE.1 C57.1 C58.1 C59.1 C60.1 C61.1 C62.1 H16.2 H16.4 H16.6 H16.8 H16.10 H16.12 L6.2 R29.1
6.5V: 6V5.1 6V5#2.1 C46.1 C47.1 C48.1 C49.1 C50.1 C51.1 H15.2 H15.4 H15.6 H15.8 H15.10 H15.12 L5.2 R27.1
GND: C27.1 C30.1 C31.1 C32.1 C35.2 C36.2 C37.2 C38.2 C39.2 C40.2 CN1.1 D4.2 H1.25 H1.27 H1.29 H2.13 H2.14 H2.26 H2.28 H2.30 H3.2 H4.2 H6.2 H7.2 H8.1 H8.3 H8.5 H8.7 H8.9 H8.11 H10.2 H14.15 H14.16 H14.17 H14.18 H14.19 H14.20 H14.21 H17.6 H18.1 R26.2 SYSTEM_ENABLE.1 TP16.1 U7.6 U7.9 USER_ENABLE.1
PGND: C41.1 C43.1 C44.1 C45.1 C46.2 C47.2 C48.2 C49.2 C50.2 C51.2 C52.1 C54.1 C55.1 C56.1 C57.2 C58.2 C59.2 C60.2 C61.2 C62.2 CN2.1 D5.2 D6.2 GND_SAMPLE.1 GND_SAMPLE#2.1 H15.1 H15.3 H15.5 H15.7 H15.9 H15.11 H16.1 H16.3 H16.5 H16.7 H16.9 H16.11 R28.2 R30.2 U8.6 U8.9 U9.6 U9.9
PA11: H2.20 H17.3 SYSTEM_ENABLE.2
PA15: H2.18 H17.2 USER_ENABLE.2

Pads without a net: CN1 3 4; CN2 3 4; H20 1; SCREW1 1; SCREW1#2 1; SCREW1#3 1; SCREW1#4 1; U7 2 3 5; U8 2 3 5; U9 2 3 5

## Via types
v1: diameter 0.61, hole 0.305, Top Layer to Bottom Layer, 12 vias

## Routing (per net, layer and track width the routed paths; a pad name or vN(x,y) marks a point on that pad's centre or on a via; arc(x,y) is an arc through that point)
3V3: length 56
  Top Layer w0.254: 94.87,32.44 94.85,32.46 3V3.1
  Top Layer w0.508: H10.1 94.87,58.85 H14.14 H14.13 H14.12 H14.11 H14.10 H14.9 H14.8
5V: length 107.9
  Top Layer w0.254: TP17.1 59.34,97.08 H8.2
  Top Layer w1.27: H1.26 47.66,71.39 44.58,74.47 6.6,74.47 3.56,71.42 3.56,31.8 11.45,23.91 14.83,23.91 15.21,23.53
5V_SAMPLE: length 27.3
  Top Layer w0.508: C57.1 62.23,17.94 62.74,17.43 62.74,7.54 H16.12 H16.10 H16.8 H16.4 H16.2
6.5V: length 104.6
  Top Layer w0.254: H15.2 69.34,43.36 70.54,42.16 6V5.1
  Top Layer w1.27: H15.2 H15.4 H15.6 H15.8 H15.10 H15.12 63.63,64.57 13.46,64.57 6.6,57.71 6.6,50.22 9.27,47.55 13.79,47.55 L5.2
12V: length 15.6
  Top Layer w0.254: 34.04,17.45 34.05,17.44 TP15.1
  Top Layer w1.016: CN1.2 33.74,19.4 32.35,20.79 C32.2
12V_SAMPLE: length 86.3
  Top Layer w0.254: CN2.2 74.77,11.79 TP13.1
  Top Layer w0.762: 74.76,16.09 79.5,20.83 79.5,27.48 74.42,32.56 52.96,32.56 41.72,43.8 C45.2 ; 74.76,16.09 72.45,18.4 C56.2 ; 74.76,16.09 CN2.2
GND:
  vias: v1(13.33,25.32) v1(14.1,25.32) v1(14.86,25.32)
PGND: length 56.7
  Top Layer w1.27: H15.7 H15.5 H15.3 H15.1 ; H15.11 H15.9
  Bottom Layer w1.27: H15.9 H15.7 H15.5 H15.3 H15.1 71.88,38.29 73.28,36.89 73.28,15.3 CN2.1
ADC1_IN1: length 101.7
  Top Layer w0.254: TP18.1 92.29,14.56 H14.1
  Inner1 w0.254: H1.6 22.35,71.01 23.58,69.78 23.58,61.06 70.1,14.53 H14.1
ADC1_IN2: length 100.9
  Top Layer w0.254: TP19.1 92.28,17.12 H14.2
  Inner2 w0.254: H1.5 22.35,63.93 66.31,19.97 91.21,19.97 91.9,20.65 92.76,20.65 93.37,20.04 93.37,18.11 H14.2
ADC1_IN6: length 101
  Top Layer w0.254: TP20.1 92.26,19.68 H14.3
  Inner2 w0.254: H14.3 66.17,19.61 18.58,67.2 18.58,70.08 H1.2
ADC1_IN9: length 99.4
  Top Layer w0.254: TP21.1 92.25,22.23 H14.4
  Inner2 w0.254: H1.3 21.11,70.16 22.78,70.16 23.66,69.28 23.66,63.12 64.63,22.15 H14.4
ADC1_IN12: length 89.3
  Top Layer w0.254: TP22.1 92.3,24.66 H14.5
  Inner1 w0.254: H14.5 60.45,24.69 35.05,50.09 H1.15
ADC1_IN15: length 88
  Top Layer w0.254: H14.6 89.66,27.23 TP23.1
  Inner2 w0.254: H14.6 60.06,27.23 32.51,54.78 H1.13
ADC2_IN12: length 85.8
  Top Layer w0.254: TP24.1 89.65,29.77 H14.7
  Inner1 w0.254: H1.17 37.59,48.05 55.87,29.77 H14.7
DC: length 19.5
  Inner2 w0.254: H18.6 92.97,50.72 86.6,44.36 81.9,44.36 H20.2
PA2: length 78.7
  Bottom Layer w0.254: H1.8 26.2,70.08 26.2,68.34 28.68,65.86 52.86,65.86 53.69,66.69 90.38,66.69 97.16,73.46
PA3: length 75.9
  Bottom Layer w0.254: H4.4 95.12,70.92 90.53,66.33 53.83,66.33 53.01,65.51 28.53,65.51 25.19,68.85 H1.7
PA4: length 81.7
  Inner1 w0.254: H7.6 89.65,86.02 89.65,92.97 88.99,93.64 88.05,93.64 87.39,92.97 87.39,91.88 72.24,76.73 31.34,76.73 27.43,72.82 27.43,71.39
PA5: length 69.3
  Inner1 w0.254: 29.97,71.39 29.97,74.85 31.49,76.38 72.39,76.38 88.52,92.51
PA6: length 63.7
  Inner1 w0.254: H1.14 32.61,71.39 37.24,76.02 72.54,76.02 86.48,89.97 H7.4
PA7: length 61.2
  Inner1 w0.254: H1.16 35.05,73.33 37.39,75.67 72.69,75.67 84.45,87.43 88.52,87.43
PA8: length 57
  Top Layer w0.254: TP5.1 71.9,74.36 U1.2 71.88,74.4 69.55,76.73 54.48,76.73 41.4,89.81 41.4,97.25 40.64,98.02 39.62,98.02 38.82,97.22 38.82,95.48 H2.17
PA11: length 115.7
  Top Layer w0.254: H17.3 48.13,54.03 50.04,52.12 56.9,52.12 SYSTEM_ENABLE.2
  Inner2 w0.254: H2.20 38.29,98.63 14.63,98.63 13.84,97.84 13.84,93.78 17.14,90.47 36.25,90.47 55.95,70.77 55.95,64.31 48.21,56.57 H17.3
PA12: length 48.3
  Top Layer w0.254: TP6.1 66.25,71.81 U1.3 70.47,72.94 70.47,75.31 69.4,76.38 52.83,76.38 40.13,89.08 H2.19
PA15: length 126.6
  Top Layer w0.254: USER_ENABLE.2 56.51,45.01 47.88,45.01 45.59,47.3 H17.2
  Inner2 w0.203: H17.2 46.72,55.44 48.6,55.44 49.26,56.1 49.26,57.15 56.28,64.17 56.28,70.9 36.36,90.83 17.29,90.83 14.2,93.92 14.2,97.69 14.81,98.3 35.28,98.3 36.28,97.3 36.28,97.09 36.57,96.79 H2.18
PB3: length 63.6
  Top Layer w0.254: TP10.1 69.34,83.87 U2.1
  Bottom Layer w0.254: U2.1 67.16,81.69 27.58,81.69 26.16,83.11 26.16,95.52 H2.8
PB4: length 60.5
  Top Layer w0.254: TP4.1 69.34,81.33 U2.3
  Bottom Layer w0.254: H2.7 25.81,93.33 25.81,82.96 27.44,81.33 U2.3
PB5: length 65.4
  Top Layer w0.254: U2.5 69.33,78.78 TP9.1
  Bottom Layer w0.254: H2.6 22.35,96.32 23.62,95.05 23.62,84.64 27.29,80.97 67.16,80.97 U2.5
PB6: length 111.6
  Inner2 w0.254: H20.3 72.77,37.77 53.97,37.77 50.67,41.07 H17.4 56.92,62.81 56.92,71.17 35.78,92.31 24.29,92.31 H2.5
PB7: length 144.2
  Inner2 w0.203: H17.1 44.49,55.13 48.73,55.13 49.57,55.97 49.57,57.02 56.59,64.04 56.59,71.03 36.43,91.19 17.37,91.19 14.56,94 14.56,97.62 14.93,98 18.6,98 H2.4
  Inner2 w0.254: H19.3 82.81,45.77 81.68,44.64 80.15,44.64 72.92,37.41 53.83,37.41 43.05,48.19 H17.1
PB9: length 73.3
  Top Layer w0.254: 67.36,69.35 69.26,69.35 U1.5 ; 67.36,69.35 TP11.1 ; 67.36,69.35 61.04,75.67 26.75,75.67 15.11,87.3 15.11,94.64 H2.2
PB10: length 59.6
  Inner1 w0.254: H1.19 45.07,63.91 v1(83.51,63.91)
  Bottom Layer w0.254: v1(83.51,63.91) 95.78,63.91 H6.3
PB11: length 65.3
  Inner1 w0.254: v1(80.59,61.25) 45.99,61.25 38.9,68.34 38.9,70.16 H1.20
  Bottom Layer w0.254: v1(80.59,61.25) 95.9,61.25 H6.4
PB12: length 75.3
  Inner1 w0.254: H1.21 41.4,70.12 41.4,71.86 42.51,72.98 53.48,72.98 60.29,66.17 75.77,66.17 79.61,70 87.65,70 91.31,66.34 91.31,59.11 H18.7
PB13: length 80.5
  Inner1 w0.254: H18.3 90.93,49.33 90.93,66.22 87.5,69.65 79.76,69.65 75.92,65.81 60.15,65.81 53.34,72.62 43.49,72.62 42.67,71.8 H1.22
PB14: length 66.8
  Inner1 w0.254: 84.46,40.69 86.36,42.6 86.36,63.17 84.43,65.1 48.96,65.1 H1.23
PB15: length 84.8
  Inner1 w0.254: H1.24 45.21,70.59 46.44,69.36 46.44,68.17 49.15,65.46 76.2,65.46 80.03,69.29 87.36,69.29 90.58,66.07 90.58,47.65 96.27,41.96 97.92,41.96 98.81,42.85 98.81,43.99 H18.4
PC1: length 67.1
  Top Layer w0.254: H1.1 17.27,68.49 18.66,67.1 71.31,67.1 73.28,69.07 73.28,70.41 U1.4 77.82,71.81 TP1.1
PC2: length 64.4
  Top Layer w0.254: v1(75.31,69.27) 77.79,69.27 77.79,69.36 ; U1.6 71.88,69.14 70.19,67.45 18.83,67.45 18.58,67.71 18.58,70.16 H1.4
  Inner2 w0.254: U1.6 v1(75.31,69.27)
PC4: length 70.6
  Bottom Layer w0.254: H1.18 38.9,70.08 38.9,67.33 39.65,66.57 52.57,66.57 63,77.01 72.77,77.01 78.87,83.11 95.88,83.11 H3.3
PC5: length 75.5
  Bottom Layer w0.254: H3.4 96.24,82.75 79.02,82.75 72.9,76.63 63.13,76.63 52.71,66.22 32.6,66.22 29.97,68.85
PC6: length 38.8
  Top Layer w0.254: U2.2 71.95,83.94 TP8.1
  Bottom Layer w0.254: H2.23 45.21,92.22 50.38,87.05 69.07,87.05 71.88,84.23 U2.2
PC7: length 45.2
  Top Layer w0.254: U2.4 71.96,81.41 TP30.1
  Bottom Layer w0.254: H2.24 45.21,95.99 46.44,94.76 46.44,91.49 50.52,87.4 69.95,87.4 73.01,84.34 73.01,82.46 U2.4
PC8: length 44.9
  Top Layer w0.254: TP7.1 71.93,78.84 U2.6
  Bottom Layer w0.254: U2.6 70.47,80.2 70.47,85.14 68.92,86.69 50.23,86.69 H2.21
PC9: length 76.7
  Inner2 w0.254: H2.22 41.44,95.56 41.44,89.17 65.55,65.05 80.02,65.05 83.75,61.32 88.92,61.32 89.65,60.59 89.65,53.63 H10.6
PC10: length 69.7
  Inner2 w0.254: H2.16 36.32,95.52 36.32,93.78 65.41,64.69 79.87,64.69 84.45,60.12 H10.3
PC11: length 68.7
  Inner2 w0.254: H10.4 86.48,57.58 79.73,64.34 65.26,64.34 35.35,94.25 H2.15
PC12: length 79.4
  Inner2 w0.254: 27.43,96.79 27.43,96.32 28.74,95.01 28.74,93.74 29.46,93.02 36.07,93.02 65.11,63.98 79.58,63.98 H10.5
PC13: length 68.5
  Top Layer w0.254: TP3.1 66.25,74.3 66.29,74.35 U1.1 67.67,76.02 26.89,76.02 17.27,85.65 H2.1
PD2: length 55.8
  Inner2 w0.254: 27.43,94.25 27.73,94.25 29.31,92.67 35.92,92.67 57.28,71.31 57.28,62.67 53.21,58.6 H17.5
RES: length 14.8
  Inner2 w0.254: H18.5 90.93,48.18 85.98,43.23 H19.2
$1N5568: length 8.9
  Top Layer w0.254: C28.2 v1(29.52,25.2) ; v1(24.26,26.85) 24,27.1 U7.1
  Bottom Layer w0.254: v1(24.26,26.85) 29.08,26.85 29.52,26.41 v1(29.52,25.2)
$1N5569: length 4.1
  Top Layer w0.254: U7.4 20.19,26.97 19.95,26.73 R26.1 R25.2
$2N774: length 11.2
  Top Layer w0.254: C53.2 v1(71.37,23.67) ; v1(65.89,25.89) 65.91,25.92 65.91,26.85 65.53,27.23 64.64,27.23 64.25,26.84 U9.1
  Bottom Layer w0.254: v1(71.37,23.67) 70.74,24.31 67.47,24.31 v1(65.89,25.89)
$2N778: length 5.6
  Top Layer w0.254: R29.2 R30.1 59.83,24.7 60.44,25.31 U9.4
$2N2987: length 11.5
  Top Layer w0.254: v1(24.83,53.58) 24.13,52.88 U8.1 ; v1(30.35,49.33) C42.2
  Bottom Layer w0.254: v1(30.35,49.33) 30.35,49.77 26.54,53.58 v1(24.83,53.58)
$2N2990: length 5.3
  Top Layer w0.254: U8.4 20.32,50.72 19.95,50.35 R28.1 R27.2

## Copper pours and planes (outline as drawn; the poured copper is in the pictures)
3V3 on Inner1: -5.97,103.56 111.25,103.56 111.25,-9.73 -5.97,-9.73
5V on Top Layer: 8.76,20.12 9.02,19.86 21.08,19.86 21.21,19.99 21.21,21.51 20.95,21.77 19.69,21.77 19.43,22.02 19.43,24.37 19.33,24.47 9.3,24.47 8.76,23.93
5V on Inner2: -17.4,111.43 126.62,111.43 126.62,58.72 -17.4,58.72
5V_SAMPLE on Top Layer: 46.61,17.18 46.86,16.93 61.63,16.93 61.98,17.32 61.98,18.47 61.71,18.83 59.38,18.83 59.38,21.43 57.28,21.43 55.66,23.05 48.67,23.05 46.61,20.99
6.5V on Top Layer: 16.64,48.56 16.64,47.93 16.89,47.68 18.67,47.68 19.3,47.04 19.3,44.12 18.71,43.52 18.71,43.48 6.33,43.48 6.1,43.72 6.1,47.85 6.88,48.56
12V on Top Layer: 22.1,20.53 22.42,20.2 31.71,20.2 31.71,21.77 23.62,21.77 23.37,22.02 23.37,23.42 23.11,23.67 22.22,23.67 22.1,23.55
12V_SAMPLE on Top Layer: 62.58,21.9 62.35,21.61 62.35,19.87 62.87,19.35 62.87,18.13 63.3,17.7 70.6,17.7 70.99,18.09 70.99,19.23 70.61,19.61 63.76,19.61 63.62,19.75 63.62,21.61 63.37,21.9
12V_SAMPLE on Top Layer: 22.55,47.22 22.22,46.9 22.22,43.1 30.13,43.1 30.48,43.45 30.48,44.37 30.1,44.75 23.62,44.75 23.62,46.92 23.32,47.22
GND on Top Layer: -17.65,108.38 104.01,108.38 104.01,-4.01 -17.65,-4.01
GND on Bottom Layer: -10.54,113.84 109.47,113.84 109.47,-12.4 -10.54,-12.4
PGND on Top Layer: 44.32,-3.89 85.22,-3.89 85.22,33.45 82.68,35.99 54.61,35.99 32.13,58.47 11.3,58.47 4.95,52.12 4.95,38.53 5.59,37.9 41.68,37.9 44.32,35.26
$1N5567 on Top Layer: 23.62,23.29 23.88,23.55 25.02,23.55 25.53,24.05 28.19,24.05 28.83,23.42 30.61,23.42 30.73,23.55 30.73,28.25 29.72,29.26 17.27,29.26 17.02,29.01 17.02,27.36 16.76,27.1 13.72,27.1 13.46,27.36 13.46,30.78 13.97,31.29 31.37,31.29 33.15,29.51 33.15,22.15 32.77,21.77 23.75,21.77 23.62,21.9
$2N775 on Top Layer: 51.94,24.56 52.45,24.05 56.01,24.05 56.39,24.44 56.39,27.74 57.15,28.5 71.12,28.5 73.03,26.59 73.03,22.4 72.26,21.64 70.49,21.64 69.22,22.91 65.03,22.91 63.72,21.61 63.72,20.15 64.01,19.86 73.22,19.86 74.55,21.2 74.55,26.59 71.37,29.77 53.71,29.77 51.94,28.12
$2N2986 on Top Layer: 11.3,53.77 11.3,49.96 11.68,49.58 15.99,49.58 16.51,50.1 16.51,52.76 17.4,53.64 27.81,53.64 27.94,53.77 31.5,50.22 31.5,47.17 31.24,46.91 30.1,46.91 28.32,48.69 25.53,48.69 23.75,46.91 23.75,45.39 24.13,45.01 32.25,45.01 33.07,45.83 33.07,51.05 28.57,55.55 13.21,55.68

## Text on the board
Top Silkscreen Layer: ADC2_12 | ADC1_2 | ADC1_15 | ADC1_12 | ADC1_9 | ADC1_6 | ADC1_1 | GND | B7 | A15 | A11 | B6 | D2 | -> OLED | -> 3V3 | 5V | MISO3 | MOSI3 | MISO1 | MOSI1 | SCK3 | SCK1 | 3v3 | CS3 | CS1 | MOSI2 | SCK2 | TX1 | RX1 | TX2 | RX2 | TX3 | RX3 | 6V5 | 3V3 | SAMPLE_SOURCE | TIM8_N1 | TIM8_N2 | TIM8_N3 | TIM1_N1 | TIM1_N2 | TIM1_N3 | TIM8_P1 | TIM8_P2 | TIM8_P3 | TIM1_P1 | TIM1_P2 | TIM1_P3 | -> 烧录
